# Altium project Lucas Emanuel - PCEIoT.PrjPcb (part 1 of 2)
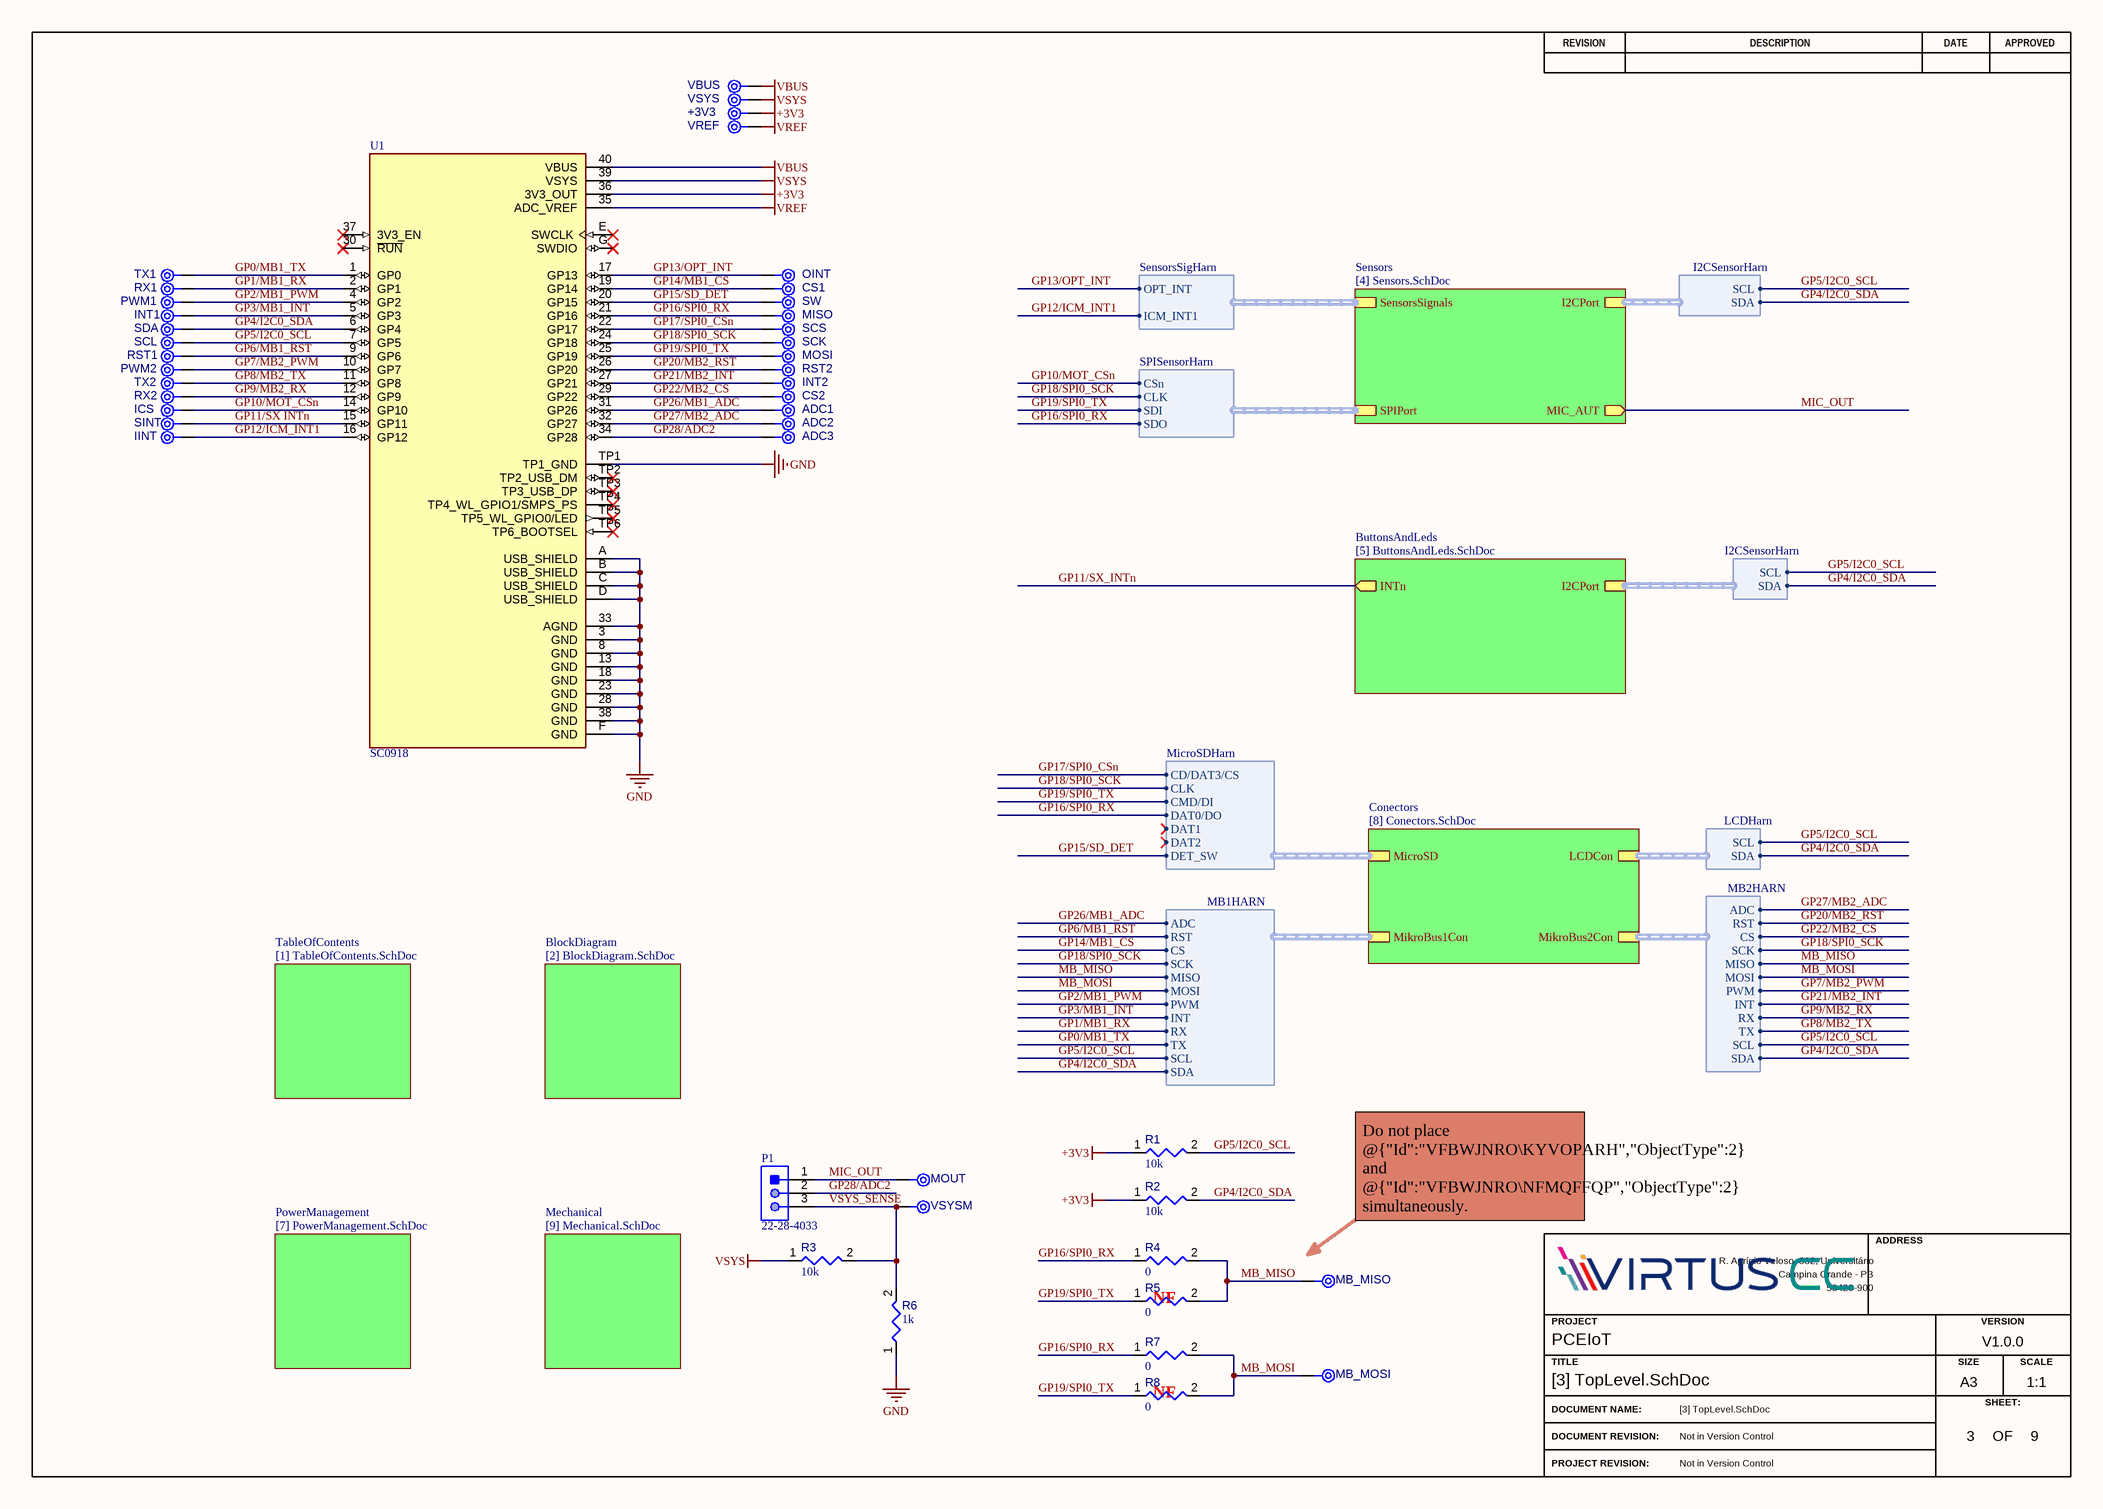
[diagram p0: [3] TopLevel.SchDoc]
Address1: R. Aprígio Veloso, 882, Universitário; Address2: Campina Grande - PB; Address3: 58429-900; DocumentRev: Not in Version Control; Project: PCEIoT; ProjectRev: Not in Version Control; SCH_SCALE: 1:1; Version: V1.0.0
9 sheets, 171 parts. Net scope: hierarchical (ports join the sheet entries above them; power ports are global).
Board file: PCB1.PcbDoc
Sheets:
  [3] TopLevel.SchDoc
    PowerManagement = [7] PowerManagement.SchDoc
    TableOfContents = [1] TableOfContents.SchDoc
    BlockDiagram = [2] BlockDiagram.SchDoc
    Mechanical = [9] Mechanical.SchDoc
    Sensors = [4] Sensors.SchDoc
    ButtonsAndLeds = [5] ButtonsAndLeds.SchDoc
      "RGB LEDs"1 = [6] RgbLed.SchDoc
      "RGB LEDs"2 = [6] RgbLed.SchDoc
      "RGB LEDs"3 = [6] RgbLed.SchDoc
    Conectors = [8] Conectors.SchDoc

## Sheet [3] TopLevel.SchDoc
size A3; DocumentNumber: 3; SheetNumber: 3; SheetTotal: 9

### Parts
+3V3  TPAD6R  [TP06R]  (value not drawn)  (no BOM)
ADC1  TPAD6R  [TP06R]  (value not drawn)  (no BOM)
ADC2  TPAD6R  [TP06R]  (value not drawn)  (no BOM)
ADC3  TPAD6R  [TP06R]  (value not drawn)  (no BOM)
CS1  TPAD6R  [TP06R]  (value not drawn)  (no BOM)
CS2  TPAD6R  [TP06R]  (value not drawn)  (no BOM)
ICS  TPAD6R  [TP06R]  (value not drawn)  (no BOM)
IINT  TPAD6R  [TP06R]  (value not drawn)  (no BOM)
INT1  TPAD6R  [TP06R]  (value not drawn)  (no BOM)
INT2  TPAD6R  [TP06R]  (value not drawn)  (no BOM)
MB_MISO  TPAD6R  [TP06R]  (value not drawn)  (no BOM)
MB_MOSI  TPAD6R  [TP06R]  (value not drawn)  (no BOM)
MISO  TPAD6R  [TP06R]  (value not drawn)  (no BOM)
MOSI  TPAD6R  [TP06R]  (value not drawn)  (no BOM)
MOUT  TPAD6R  [TP06R]  (value not drawn)  (no BOM)
OINT  TPAD6R  [TP06R]  (value not drawn)  (no BOM)
P1  22-28-4033  [MOLX-22-28-4033_V]
PWM1  TPAD6R  [TP06R]  (value not drawn)  (no BOM)
PWM2  TPAD6R  [TP06R]  (value not drawn)  (no BOM)
R1  value 10k  [RESC0603(1608)_L]  (hidden comment: Resistor 10k +/-1% 0603 100 mW)
R2  value 10k  [RESC0603(1608)_L]  (hidden comment: Resistor 10k +/-1% 0603 100 mW)
R3  value 10k  [RESC0603(1608)_L]  (hidden comment: Resistor 10k +/-1% 0603 100 mW)
R4  value 0  [RESC0603(1608)_L]  (hidden comment: Resistor 0R +/- 5% 0603 100 mW)
R5  value 0  [RESC0603(1608)_L]  (hidden comment: Resistor 0R +/- 5% 0603 100 mW)
R6  value 1k  [RESC0603(1608)_L]  (hidden comment: Resistor 1k +/-1% 0603 100 mW)
R7  value 0  [RESC0603(1608)_L]  (hidden comment: Resistor 0R +/- 5% 0603 100 mW)
R8  value 0  [RESC0603(1608)_L]  (hidden comment: Resistor 0R +/- 5% 0603 100 mW)
RST1  TPAD6R  [TP06R]  (value not drawn)  (no BOM)
RST2  TPAD6R  [TP06R]  (value not drawn)  (no BOM)
RX1  TPAD6R  [TP06R]  (value not drawn)  (no BOM)
RX2  TPAD6R  [TP06R]  (value not drawn)  (no BOM)
SCK  TPAD6R  [TP06R]  (value not drawn)  (no BOM)
SCL  TPAD6R  [TP06R]  (value not drawn)  (no BOM)
SCS  TPAD6R  [TP06R]  (value not drawn)  (no BOM)
SDA  TPAD6R  [TP06R]  (value not drawn)  (no BOM)
SINT  TPAD6R  [TP06R]  (value not drawn)  (no BOM)
SW  TPAD6R  [TP06R]  (value not drawn)  (no BOM)
TX1  TPAD6R  [TP06R]  (value not drawn)  (no BOM)
TX2  TPAD6R  [TP06R]  (value not drawn)  (no BOM)
U1  SC0918  [MODULE_SC0918]
VBUS  TPAD6R  [TP06R]  (value not drawn)  (no BOM)
VREF  TPAD6R  [TP06R]  (value not drawn)  (no BOM)
VSYS  TPAD6R  [TP06R]  (value not drawn)  (no BOM)
VSYSM  TPAD6R  [TP06R]  (value not drawn)  (no BOM)

### Sub-sheets
BlockDiagram = [2] BlockDiagram.SchDoc: no entries
ButtonsAndLeds = [5] ButtonsAndLeds.SchDoc: INTn (out), I2CPort (harness I2CSensorHarn)
Conectors = [8] Conectors.SchDoc: MikroBus2Con (harness MB2HARN), MikroBus1Con (harness MB1HARN), MicroSD (harness MicroSDHarn), LCDCon (harness LCDHarn)
Mechanical = [9] Mechanical.SchDoc: no entries
PowerManagement = [7] PowerManagement.SchDoc: no entries
Sensors = [4] Sensors.SchDoc: SPIPort (harness SPISensorHarn), SensorsSignals (harness SensorsSigHarn), I2CPort (harness I2CSensorHarn), MIC_AUT (out)
TableOfContents = [1] TableOfContents.SchDoc: no entries

### Harnesses
I2CSensorHarn: SCL, SDA
SensorsSigHarn: OPT_INT, ICM_INT1
SPISensorHarn: CSn, CLK, SDI, SDO
LCDHarn: SCL, SDA
MB2HARN: ADC, RST, CS, SCK, MISO, MOSI, PWM, INT, RX, TX, SCL, SDA
MB1HARN: ADC, RST, CS, SCK, MISO, MOSI, PWM, INT, RX, TX, SCL, SDA
MicroSDHarn: CLK, CMD/DI, DAT0/DO, DAT1, DAT2, CD/DAT3/CS, DET_SW

### Nets
+3V3: +3V3.1(TP) R1.1 R2.1 U1.36(3V3_OUT)
GND: R6.1 U1.3(GND) U1.8(GND) U1.13(GND) U1.18(GND) U1.23(GND) U1.28(GND) U1.33(AGND) U1.38(GND) U1.A(USB_SHIELD) U1.B(USB_SHIELD) U1.C(USB_SHIELD) U1.D(USB_SHIELD) U1.F(GND) U1.TP1(TP1_GND)
VBUS: U1.40(VBUS) VBUS.1(TP)
VREF: U1.35(ADC_VREF) VREF.1(TP)
VSYS: R3.1 U1.39(VSYS) VSYS.1(TP)
GP0/MB1_TX: TX1.1(TP) U1.1(GP0) ; sheet Conectors/MikroBus1Con.TX
GP1/MB1_RX: RX1.1(TP) U1.2(GP1) ; sheet Conectors/MikroBus1Con.RX
GP2/MB1_PWM: PWM1.1(TP) U1.4(GP2) ; sheet Conectors/MikroBus1Con.PWM
GP3/MB1_INT: INT1.1(TP) U1.5(GP3) ; sheet Conectors/MikroBus1Con.INT
GP4/I2C0_SDA: R2.2 SDA.1(TP) U1.6(GP4) ; sheet Sensors/I2CPort.SDA, sheet Conectors/LCDCon.SDA, sheet Conectors/MikroBus2Con.SDA, sheet Conectors/MikroBus1Con.SDA, sheet ButtonsAndLeds/I2CPort.SDA
GP5/I2C0_SCL: R1.2 SCL.1(TP) U1.7(GP5) ; sheet Sensors/I2CPort.SCL, sheet Conectors/LCDCon.SCL, sheet Conectors/MikroBus2Con.SCL, sheet Conectors/MikroBus1Con.SCL, sheet ButtonsAndLeds/I2CPort.SCL
GP6/MB1_RST: RST1.1(TP) U1.9(GP6) ; sheet Conectors/MikroBus1Con.RST
GP7/MB2_PWM: PWM2.1(TP) U1.10(GP7) ; sheet Conectors/MikroBus2Con.PWM
GP8/MB2_TX: TX2.1(TP) U1.11(GP8) ; sheet Conectors/MikroBus2Con.TX
GP9/MB2_RX: RX2.1(TP) U1.12(GP9) ; sheet Conectors/MikroBus2Con.RX
GP10/MOT_CSn: ICS.1(TP) U1.14(GP10) ; sheet Sensors/SPIPort.CSn
GP11/SX INTn: SINT.1(TP) U1.15(GP11)
GP12/ICM_INT1: IINT.1(TP) U1.16(GP12) ; sheet Sensors/SensorsSignals.ICM_INT1
GP13/OPT_INT: OINT.1(TP) U1.17(GP13) ; sheet Sensors/SensorsSignals.OPT_INT
GP14/MB1_CS: CS1.1(TP) U1.19(GP14) ; sheet Conectors/MikroBus1Con.CS
GP15/SD_DET: SW.1(TP) U1.20(GP15) ; sheet Conectors/MicroSD.DET_SW  [project net DET_SW]
GP16/SPI0_RX: MISO.1(TP) R4.1 R7.1 U1.21(GP16) ; sheet Sensors/SPIPort.SDO, sheet Conectors/MicroSD.DAT0/DO  [project net DO]
GP17/SPI0_CSn: SCS.1(TP) U1.22(GP17) ; sheet Conectors/MicroSD.CD/DAT3/CS  [project net CS]
GP18/SPI0_SCK: SCK.1(TP) U1.24(GP18) ; sheet Sensors/SPIPort.CLK, sheet Conectors/MikroBus2Con.SCK, sheet Conectors/MikroBus1Con.SCK, sheet Conectors/MicroSD.CLK  [project net CLK]
GP19/SPI0_TX: MOSI.1(TP) R5.1 R8.1 U1.25(GP19) ; sheet Sensors/SPIPort.SDI, sheet Conectors/MicroSD.CMD/DI  [project net DI]
GP20/MB2_RST: RST2.1(TP) U1.26(GP20) ; sheet Conectors/MikroBus2Con.RST
GP21/MB2_INT: INT2.1(TP) U1.27(GP21) ; sheet Conectors/MikroBus2Con.INT
GP22/MB2_CS: CS2.1(TP) U1.29(GP22) ; sheet Conectors/MikroBus2Con.CS
GP26/MB1_ADC: ADC1.1(TP) U1.31(GP26) ; sheet Conectors/MikroBus1Con.ADC
GP27/MB2_ADC: ADC2.1(TP) U1.32(GP27) ; sheet Conectors/MikroBus2Con.ADC
GP28/ADC2: ADC3.1(TP) P1.2 U1.34(GP28)
MB_MISO: MB_MISO.1(TP) R4.2 R5.2 ; sheet Conectors/MikroBus2Con.MISO, sheet Conectors/MikroBus1Con.MISO  [project net MB1_MISO]
MB_MOSI: MB_MOSI.1(TP) R7.2 R8.2 ; sheet Conectors/MikroBus2Con.MOSI, sheet Conectors/MikroBus1Con.MOSI  [project net MB1_MOSI]
MIC_OUT: MOUT.1(TP) P1.1 ; sheet Sensors/MIC_AUT
VSYS_SENSE: P1.3 R3.2 R6.2 VSYSM.1(TP)

Not connected (* = marked no-connect by the designer): U1 30(~{RUN})* 37(3V3_EN)* E(SWCLK)* G(SWDIO)* TP2(TP2_USB_DM)* TP3(TP3_USB_DP)* TP4(TP4_WL_GPIO1/SMPS_PS)* TP5(TP5_WL_GPIO0/LED)* TP6(TP6_BOOTSEL)*

### Notes on the sheet
- Do not place @{"Id":"VFBWJNRO\KYVOPARH","ObjectType":2} and @{"Id":"VFBWJNRO\NFMQFFQP","ObjectType":2} simultaneously.
  Do not place @{"Id":"VFBWJNRO\IKILTTYE","ObjectType":2} and @{"Id":"VFBWJNRO\AIELESCA","ObjectType":2} simultaneously
- (near R5) NF
- (near R8) NF
- REVISION
- DESCRIPTION
- DATE
- APPROVED
- ADDRESS
- PROJECT
- VERSION
- TITLE
- A3
- SIZE
- SCALE
- DOCUMENT NAME:
- DOCUMENT REVISION:
- OF
- SHEET:
- PROJECT REVISION:

### Library data of the parts
+3V3 ADC1-ADC3 CS1 CS2 ICS IINT INT1 INT2 MB_MISO MB_MOSI MISO MOSI MOUT OINT PWM1 PWM2 RST1 RST2 RX1 RX2 SCK SCL SCS SDA SINT SW TX1 TX2 VBUS VREF VSYS VSYSM = CMP-00028-00002-2: 0.6mm round; Pins: 1; Component Type: Mechanical
P1 = CMP-002-00076-1: KK 254 Breakaway Header Vertical 3 Circuits 0.38um Gold Selective Plating Mating Pin 6.09mm; Pitch: 2.54mm; Number of Positions: 3; Contact Resistance: 20mR; Max Voltage Rating (AC): 250V; Current Rating: 4A; Gender: Male; Glow Wire Compliant: Non-compliant; RoHS Compliant: Yes; Contact Plating: Gold; Housing Color: Black; Housing Material: Nylon; Contact Mating Length: 0.24inch; Depth: 2.49mm; Number of Circuits: 3; Reach SVHC Compliant: Unknown; Packaging: Bulk; Max Voltage Rating (DC): 250V; Number of Rows: 1; Color: Black; Package Quantity: 1; Orientation: Straight; Number of Contacts: 3; Max Operating Temperature: 75°C; Mounting Technology: Through Hole; Min Operating Temperature: 0°C; Termination: Solder; Radiation Hardening: No; Series: KK® 42375; Contact Material: Brass,Bronze; Flammability Rating: UL94 V-0; Lead Free: Lead Free; Contact Type: Male Pin; Voltage Rating: 250V; Voltage Rating (DC): 250V
R1-R3 = CMP-009-00017-7: Chip Resistor, 10 KOhm, +/- 1%, 01 W, -55 to 155 degC, 0603 (1608 Metric); Power: 100mW; Voltage Rating: 50V; Mounting Technology: SM; Max Operating Temperature: 155°C; Case/Package: 0603; Tolerance: 1%; RoHS Compliant: True; Pins: 2; Min Operating Temperature: -55°C
R4 R5 R7 R8 = CMP-009-00006-6: Chip Resistor, 0 Ohm, 0.1 W, -55 to 155 degC, 0603 (1608 Metric); Power: 100mW; Voltage Rating: 50V; Tolerance: 5%; Mounting Technology: SM; RoHS Compliant: True; Max Operating Temperature: 155°C; Min Operating Temperature: -55°C; Case/Package: 0603; Pins: 2
R6 = CMP-009-00014-6: Chip Resistor, 1 KOhm, +/-1%, 0.1 W, -55 to 155 degC, 0603 (1608 Metric); Power: 100mW; Tolerance: 1%; Voltage Rating: 50V; Mounting Technology: SM; Case/Package: 0603; Min Operating Temperature: -55°C; RoHS Compliant: True; Max Operating Temperature: 155°C; Pins: 2
U1 = CMP-006-000001-6: Raspberry Pi Pico W RP2040; Check_prices: https://www.snapeda.com/parts/SC0918/Raspberry+Pi/view-part/?ref=eda; MF: Raspberry Pi; Design Item ID: SC0918; SnapEDA_Link: https://www.snapeda.com/parts/SC0918/Raspberry+Pi/view-part/?ref=snap; Pin Count: 53; Value: *; Purchase-URL: https://pricing.snapeda.com/search/part/SC0918/?ref=eda; MP: SC0918; Source: SC0918.SchLib; Package: None; Availability: In Stock; Price: None; Component Type: Standard

## Sheet [7] PowerManagement.SchDoc
size A3; DocumentNumber: 7; SheetNumber: 7; SheetTotal: 9
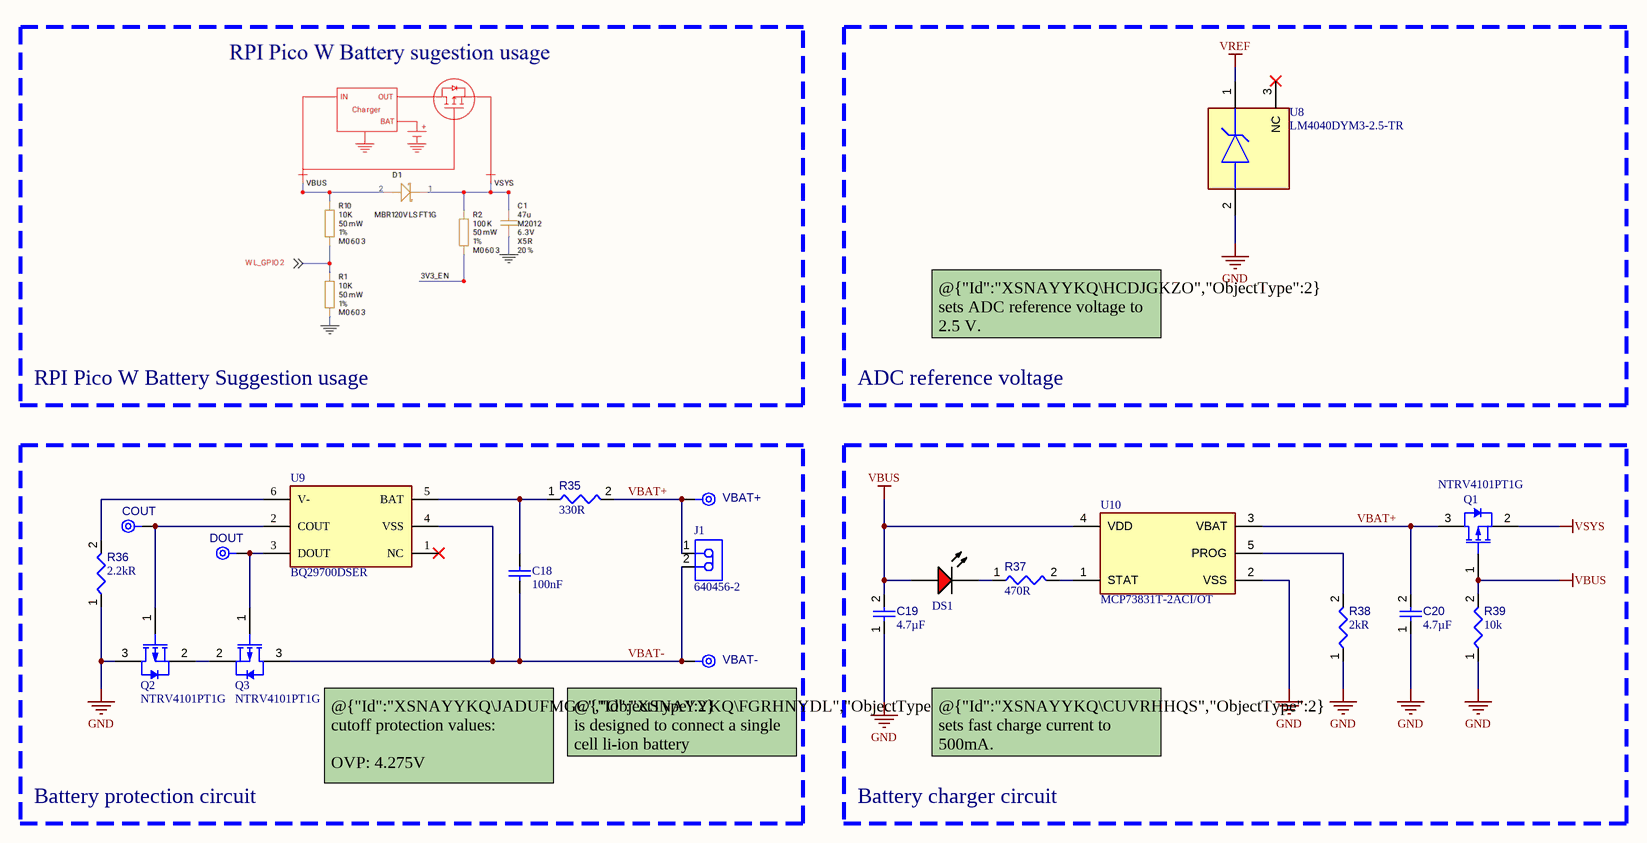
[diagram p1: [7] PowerManagement.SchDoc]

### Parts
C18  value 100nF  [CAPC0603(1608)100_L]  (hidden comment: VJ0603Y104MXJCW1BC)
C19  value 4.7µF  [CAPC0603(1608)100_L]  (hidden comment: Capacitor 4.7µF +/-20% 10V 0603)
C20  value 4.7µF  [CAPC0603(1608)100_L]  (hidden comment: Capacitor 4.7µF +/-20% 10V 0603)
COUT  TPAD6R  [TP06R]  (value not drawn)  (no BOM)
DOUT  TPAD6R  [TP06R]  (value not drawn)  (no BOM)
DS1  19-217/R6C-AL1M2VY/3T  [EVRL-0603-2_V]  (value not drawn)
J1  640456-2  [TECO-640456-2_V]
Q1  NTRV4101PT1G  [ONSC-SOT-23-3-318-08_V]
Q2  NTRV4101PT1G  [ONSC-SOT-23-3-318-08_V]
Q3  NTRV4101PT1G  [ONSC-SOT-23-3-318-08_V]
R35  value 330R  [RESC0603(1608)_L]  (hidden comment: ERJ-3EKF3300V)
R36  value 2.2kR  [RESC0603(1608)_L]  (hidden comment: CRCW06032K20FKEA)
R37  value 470R  [RESC0603(1608)_L]  (hidden comment: CRCW0603470RJNEA)
R38  value 2kR  [RESC0603(1608)_L]  (hidden comment: ERJ-3EKF2001V)
R39  value 10k  [RESC0603(1608)_L]  (hidden comment: Resistor 10k +/-1% 0603 100 mW)
U8  LM4040DYM3-2.5-TR  [FP-SOT23-3LD-PL-1-IPC_A]
U9  BQ29700DSER  [FP-DSE0006A-MFG]
U10  MCP73831T-2ACI/OT  [FP-C04-091-OT-MFG]
VBAT+  TPAD6R  [TP06R]  (value not drawn)  (no BOM)
VBAT-  TPAD6R  [TP06R]  (value not drawn)  (no BOM)

### Blocks framed on the sheet
ADC reference voltage: U8
Battery protection circuit: C18 COUT DOUT J1 Q2 Q3 R35 R36 U9 VBAT+ VBAT-
Battery charger circuit: C19 C20 DS1 Q1 R37-R39 U10

### Nets
GND: C19.1 C20.1 Q2.3(D) R36.1 R38.1 R39.1 U8.2(-) U10.2(VSS)
VBUS: C19.2 DS1.1(A) Q1.1(G) R39.2 U10.4(VDD)
VREF: U8.1(+)
VSYS: Q1.2(S)
VBAT+: C20.2 J1.1 Q1.3(D) R35.2 U10.3(VBAT) VBAT+.1(TP)
VBAT-: C18.1 J1.2 Q3.3(D) U9.4(VSS) VBAT-.1(TP)
NetC18_2: C18.2 R35.1 U9.5(BAT)
NetCOUT_1: COUT.1(TP) Q2.1(G) U9.2(COUT)
NetDOUT_1: DOUT.1(TP) Q3.1(G) U9.3(DOUT)
NetDS1_2: DS1.2(K) R37.1
NetQ2_2: Q2.2(S) Q3.2(S)
NetR36_2: R36.2 U9.6(V-)
NetR37_2: R37.2 U10.1(STAT)
NetR38_2: R38.2 U10.5(PROG)

Not connected (* = marked no-connect by the designer): U8 3(NC)*; U9 1(NC)*

### Notes on the sheet
- @{"Id":"XSNAYYKQ\HCDJGKZO","ObjectType":2} sets ADC reference voltage to 2.5 V.
- RPI Pico W Battery Suggestion usage
- (near VBAT-) @{"Id":"XSNAYYKQ\FGRHNYDL","ObjectType":2} is designed to connect a single cell li-ion battery
- @{"Id":"XSNAYYKQ\CUVRHHQS","ObjectType":2} sets fast charge current to 500mA.
- @{"Id":"XSNAYYKQ\JADUFMGC","ObjectType":2} cutoff protection values:
  OVP: 4.275V
  UVP: 2.8V
- REVISION
- DESCRIPTION
- DATE
- APPROVED
- ADDRESS
- PROJECT
- VERSION
- TITLE
- A3
- SIZE
- SCALE
- DOCUMENT NAME:
- DOCUMENT REVISION:
- OF
- SHEET:
- PROJECT REVISION:

### Library data of the parts
C18 = CMP-001-00085-1: Multilayer Ceramic Capacitor, 0.1 uF, 16 V, ± 20%, X7R, 0603 [1608 Metric]; Dielectric Material: Tantalum; Voltage Rating: 16V; Packaging: Tape and Reel; Min Operating Temperature: -55°C; Case/Package: 0603; Length: 1.6mm; Termination: SMD/SMT; Height: 0.95mm; Mounting Technology: Surface Mount; Width: 0.8mm; Case Code (Imperial): 0603; Construction: Flat; Lead Free: Lead Free; Package Quantity: 4000; Max Operating Temperature: 125°C; Dielectric: X7R; RoHS Compliant: Yes; Depth: 0.8mm; Tolerance: 20%; Series: VJ; Case Code (Metric): 1608; Voltage Rating (DC): 16V
C19 C20 = CMP-001-00076-4: Chip Capacitor, 4.7µF +/-20%, 10V, 0603, Thickness 1 mm; Tolerance: 10%; Mounting Technology: SMT; Case/Package: 0603; Pins: 2; Min Operating Temperature: -55°C; Max Operating Temperature: 85°C; Voltage Rating: 10V
COUT DOUT VBAT+ VBAT- = CMP-00028-00002-2: 0.6mm round; Pins: 1; Component Type: Mechanical
DS1 = CMP-007-00004-2: Chip LED, Red, 5 V, 25 mA, -40 to 85 degC, 2-Pin SMD (0603), RoHS, Tape and Reel; Manufacturer: Everlight Electronics; Forward Voltage: 2.2V; Lens Style: Clear; Package Reference: 0603; Datasheet Version: Rev. 1, 01/2005; Mounting Technology: SM; RoHS Compliant: False; Datasheet URL: https://datasheet.ciiva.com/4688/el-19-217-r6c-al1m2vy-3tpdf-187026-4688713.pdf; Case/Package: 0603; Colour: Red; Manufacturer URL: http://www.everlight.com/; Package Description: 2-Pin Surface Mount Device, Body 1.6 x 0.8 mm
J1 = CMP-002-00073-1: Connector 250V AC/DC 5A 2P 1 Row PCB - Vertical Mounting Polyester White; Contact Retention: No (Without); PCB Thickness: 0.063inch; Approvals: CSA; Contact Post Length: 3.56mm; Gender: Male; Circuit Application: Signal; Tail Length: 0.14inch; Plating Thickness: 3.81um; Plating: Tin; Mating Connector Lock: Yes (With); PCB Mount Retention: Without; Contact Style: Straight; Number of Positions: 2; Connector System: Wire-to-Board; Pitch: 2.54mm; Connector Type: Connector,Pin,Plug,Header; Voltage Rating: 250V; Termination: Solder; Contact Current Rating: 5A; PCB Mount Alignment: No (Without); Housing Material: Polyester; Contact Material: Copper Alloy; Current Rating: 5A; Mounting Ears: No (Without); Strain Relief: No (Without); Shrouded: No (Without); Min Operating Temperature: -67°C; Orientation: Straight; Series: MTA-100; Panel Mount Retention: No (Without); Package Quantity: 5000; Height: 7.87mm; Length: 7.62mm; PCB Mounting Orientation: Vertical; Flammability Rating: UL94 V-0; Operating Supply Voltage: 250V; Contact Plating: Tin; Mounting Technology: Through Hole; Voltage Rating (AC): 250V; Backwall/Post Interruptions: No (Without); Contact Mating Length: 7.49mm; Color: Beige; Voltage Rating (DC): 250V; Lead Free: Lead Free; Reach SVHC Compliant: Unknown; Sealable: No (Without); Mating Alignment: No (Without); Mating Retention: No (Without); Number of Contacts: 2; Contact Shape: Square; Max Operating Temperature: 221°C; Number of Rows: 1; RoHS Compliant: Yes; Housing Color: Natural
Q1-Q3 = CMP-013-00034-1: NTRV4101PT1G P-channel MOSFET Transistor; 1.7 A; 20 V; 3-Pin SOT-23; Gate to Source Voltage (Vgs): 8V; Continuous Drain Current (ID): 3.2A; Input Capacitance: 675pF; Turn-On Delay Time: 7.5ns; Rds On Max: 85mR; Power Dissipation: 1.25W; Rise Time: 12.6ns; Max Power Dissipation: 420mW; Drain to Source Resistance: 70mR; Element Configuration: Single; Turn-Off Delay Time: 30.2ns; Fall Time: 21ns; Drain to Source Voltage (Vdss): 20V; Number of Elements: 1; Case/Package: SOT-23-3; RoHS Compliant: Yes; Polarity: P-CHANNEL; Height: 1.01mm; Packaging: Tape and Reel; Series: -; Package Quantity: 3000; Max Operating Temperature: 150°C; Length: 3.04mm; Lead Free: Lead Free; Pins: 3; Radiation Hardening: No; Width: 1.4mm; Min Operating Temperature: -55°C
R35 = CMP-009-00184-1: SMD Chip Resistor, 330 Ohm, ± 1%, 100 mW, 0603 [1608 Metric], Thick Film, Precision; Current Rating: 500mA; Voltage Rating (DC): 75V; Power Rating: 100mW; Gender: Male; Temperature Coefficient: 100ppm/°C; Termination: SMD/SMT; Construction: Rectangular; Contact Plating: Tin; Resistor Type: Thick Film; Features: Automotive AEC-Q200; Max Operating Temperature: 155°C; Weight: 7.1E-05oz; Package Quantity: 5000; Lead Pitch: 1.1mm; Radiation Hardening: No; Lead Free: Lead Free; Min Operating Temperature: -55°C; Reach SVHC Compliant: No; Pins: 2; Number of Terminations: 2; Width: 0.8mm; RoHS Compliant: Yes; Depth: 0.8mm; Packaging: Tape and Reel; Voltage Rating: 75V; Mounting Technology: Surface Mount; Case Code (Metric): 1608; Resistance Tolerance: 1%; Tolerance: 1%; Case Code (Imperial): 0603; Length: 1.6mm; Height: 0.45mm; Military Standard: Not; Series: ERJ; Max Power Dissipation: 100mW; Case/Package: 0603; Contact Material: Copper
R36 = CMP-009-00186-1: SMD Chip Resistor, 2.2 kOhm, ± 1%, 100 mW, 0603 [1608 Metric], Thick Film, General Purpose; Voltage Rating (DC): 75V; Max Power Dissipation: 100mW; Temperature Coefficient: 100ppm/°C; Depth: 0.85mm; Height: 0.45mm; Contact Plating: Tin; Resistance Tolerance: 1%; Ratings: AEC-Q200; Weight: 7.1E-05oz; Series: CRCW; Case Code (Imperial): 0603; Construction: Rectangular; Width: 0.033inch; Reach SVHC Compliant: Unknown; Case Code (Metric): 1608; Resistor Type: Thick Film; Packaging: Tape and Reel; Case/Package: 0603; Package Quantity: 10; RoHS Compliant: Yes; Lead Free: Lead Free; Military Standard: Not; Termination: SMD/SMT; Tolerance: 1%; Technology: THICK FILM; Max Operating Temperature: 155°C; Voltage Rating: 75V; Power Rating: 100mW; Length: 1.55mm; Number of Terminations: 2; Radiation Hardening: No; Min Operating Temperature: -55°C; Features: Automotive AEC-Q200
R37 = CMP-009-00182-1: Res Thick Film 0603 470 Ohm 5% 0.1W(1/10W) ±200ppm/°C Pad SMD Automotive T/R; Max Power Dissipation: 100mW; Working Voltage: 75V; Case Code (Metric): 1608; Case Code (Imperial): 0603; Width: 0.85mm; Series: CRCW; Max Operating Temperature: 155°C; Features: Automotive AEC-Q200; Height: 0.45mm; Technology: THICK FILM; Power Rating: 100mW; Depth: 0.85mm; Min Operating Temperature: -55°C; Weight: 7.1E-05oz; RoHS Compliant: Yes; Number of Terminations: 2; Voltage Rating: 75V; Ratings: AEC-Q200; Case/Package: 0603; Contact Plating: Tin; Radiation Hardening: No; Termination: SMD/SMT; Tolerance: 5%; Construction: Rectangular; Package Quantity: 5000; Reach SVHC Compliant: Unknown; Length: 1.55mm; Resistor Type: Thick Film; Lead Free: Lead Free; Temperature Coefficient: 200ppm/°C; Resistance Tolerance: 5%; Packaging: Tape and Reel; Military Standard: Not
R38 = CMP-009-00181-1: SMD Chip Resistor, 2 kOhm, ï¿½ 1%, 100 mW, 0603 [1608 Metric], Thick Film, Precision; Power Rating: 100mW; Temperature Coefficient: 100ppm/°C; Voltage Rating: 75V; Voltage Rating (DC): 50V; Construction: Rectangular; Tolerance: 1%; Case Code (Imperial): 0603; Contact Plating: Tin; Packaging: Tape and Reel; Width: 0.8mm; Length: 1.6mm; Lead Free: Lead Free; Max Operating Temperature: 155°C; Number of Terminations: 2; Features: Automotive AEC-Q200; Min Operating Temperature: -55°C; Termination: SMD/SMT; Case/Package: 0603; Max Power Dissipation: 100mW; Reach SVHC Compliant: No; Radiation Hardening: No; RoHS Compliant: Yes; Resistance Tolerance: 1%; Pins: 2; Series: ERJ; Case Code (Metric): 1608; Mounting Technology: Surface Mount; Height: 0.022inch; Military Standard: Not; Depth: 0.8mm; Package Quantity: 1; Resistor Type: Thick Film
R39 = CMP-009-00017-7: as R1 on sheet [3] TopLevel; Mounting Technology: SM; Max Operating Temperature: 155°C; Case/Package: 0603; Tolerance: 1%; RoHS Compliant: True; Pins: 2; Min Operating Temperature: -55°C
U8 = CMP-004-00033-1: LM4040 Series 2.5 V ±1 % Precision Micropower Shunt Voltage Reference - SOT-23; Max Output Voltage: 2.5V; Output Type: Fixed; Output Voltage: 10V; Cathode Current: 70uA; Temperature Coefficient: 150ppm/°C; Output Current: 15mA; Tolerance: 1%; Supply Current: 500nA; Max Operating Temperature: 85°C; Series: -; Min Output Voltage: 2.5V; Length: 2.92mm; Current Rating: 15mA; Pins: 3; Height: 1.01mm; Package Quantity: 3000; Max Output current: 15mA; Min Operating Temperature: -40°C; Packaging: Tape and Reel; Width: 1.3mm; Radiation Hardening: No; Case/Package: SOT-23; Reach SVHC Compliant: No; Reference Voltage: 2.5V; Lead Free: Lead Free; RoHS Compliant: Yes; Reference Type: Shunt; Mounting Technology: Surface Mount
U9 = CMP-001-0002-1: Li-Ion/Li Polymer Advanced Single-Cell Battery Protector IC Family 6-WSON -40 to 85; Fault Protection: Over Current,Short Circuit,Over/Under Voltage; Operating Supply Voltage: 8V; Number of Cells: 1; Case/Package: WFDFN; Lead Free: Lead Free; Pins: 6; Height: 800um; Packaging: Tape and Reel; Max Operating Temperature: 85°C; Weight: 0.000342oz; Mounting Technology: Surface Mount; Series: -; Contact Plating: Gold; Thickness: 750um; RoHS Compliant: Yes; Package Quantity: 3000; Width: 1.5mm; Length: 1.5mm; Min Operating Temperature: -40°C
U10 = CMP-001-0001-1: MCP73831 Series Single-Cell Li-Ion/Li-Polymer Battery Charge Controller SOT-23-5; Output Voltage: 4.2V; Number of Channels: 1; Fault Protection: Over Voltage; Min Supply Voltage: 3.75V; Max Supply Voltage: 6V; Max Power Dissipation: 1.54W; Output Current: 500mA; Voltage Rating: 4.534V; Drain to Source Resistance: 350mR; Min Output Voltage: 4.168V; Max Output Voltage: 4.5V; Mounting Technology: Surface Mount; Number of Outputs: 1; RoHS Compliant: Yes; Weight: 0.00709oz; Length: 3.1mm; Max Operating Temperature: 85°C; Series: -; Case/Package: SOT-23; Radiation Hardening: No; Pins: 5; Packaging: Tape and Reel; Lead Free: Lead Free; Number of Cells: 1; Width: 1.8mm; Height: 1.3mm; Max Charge Current: 500mA; Battery Pack Voltage: 4.2V; Reach SVHC Compliant: No; Termination: SMD/SMT; Min Operating Temperature: -40°C

## Sheet [1] TableOfContents.SchDoc
size A3; DocumentNumber: 1; SheetNumber: 1; SheetTotal: 9
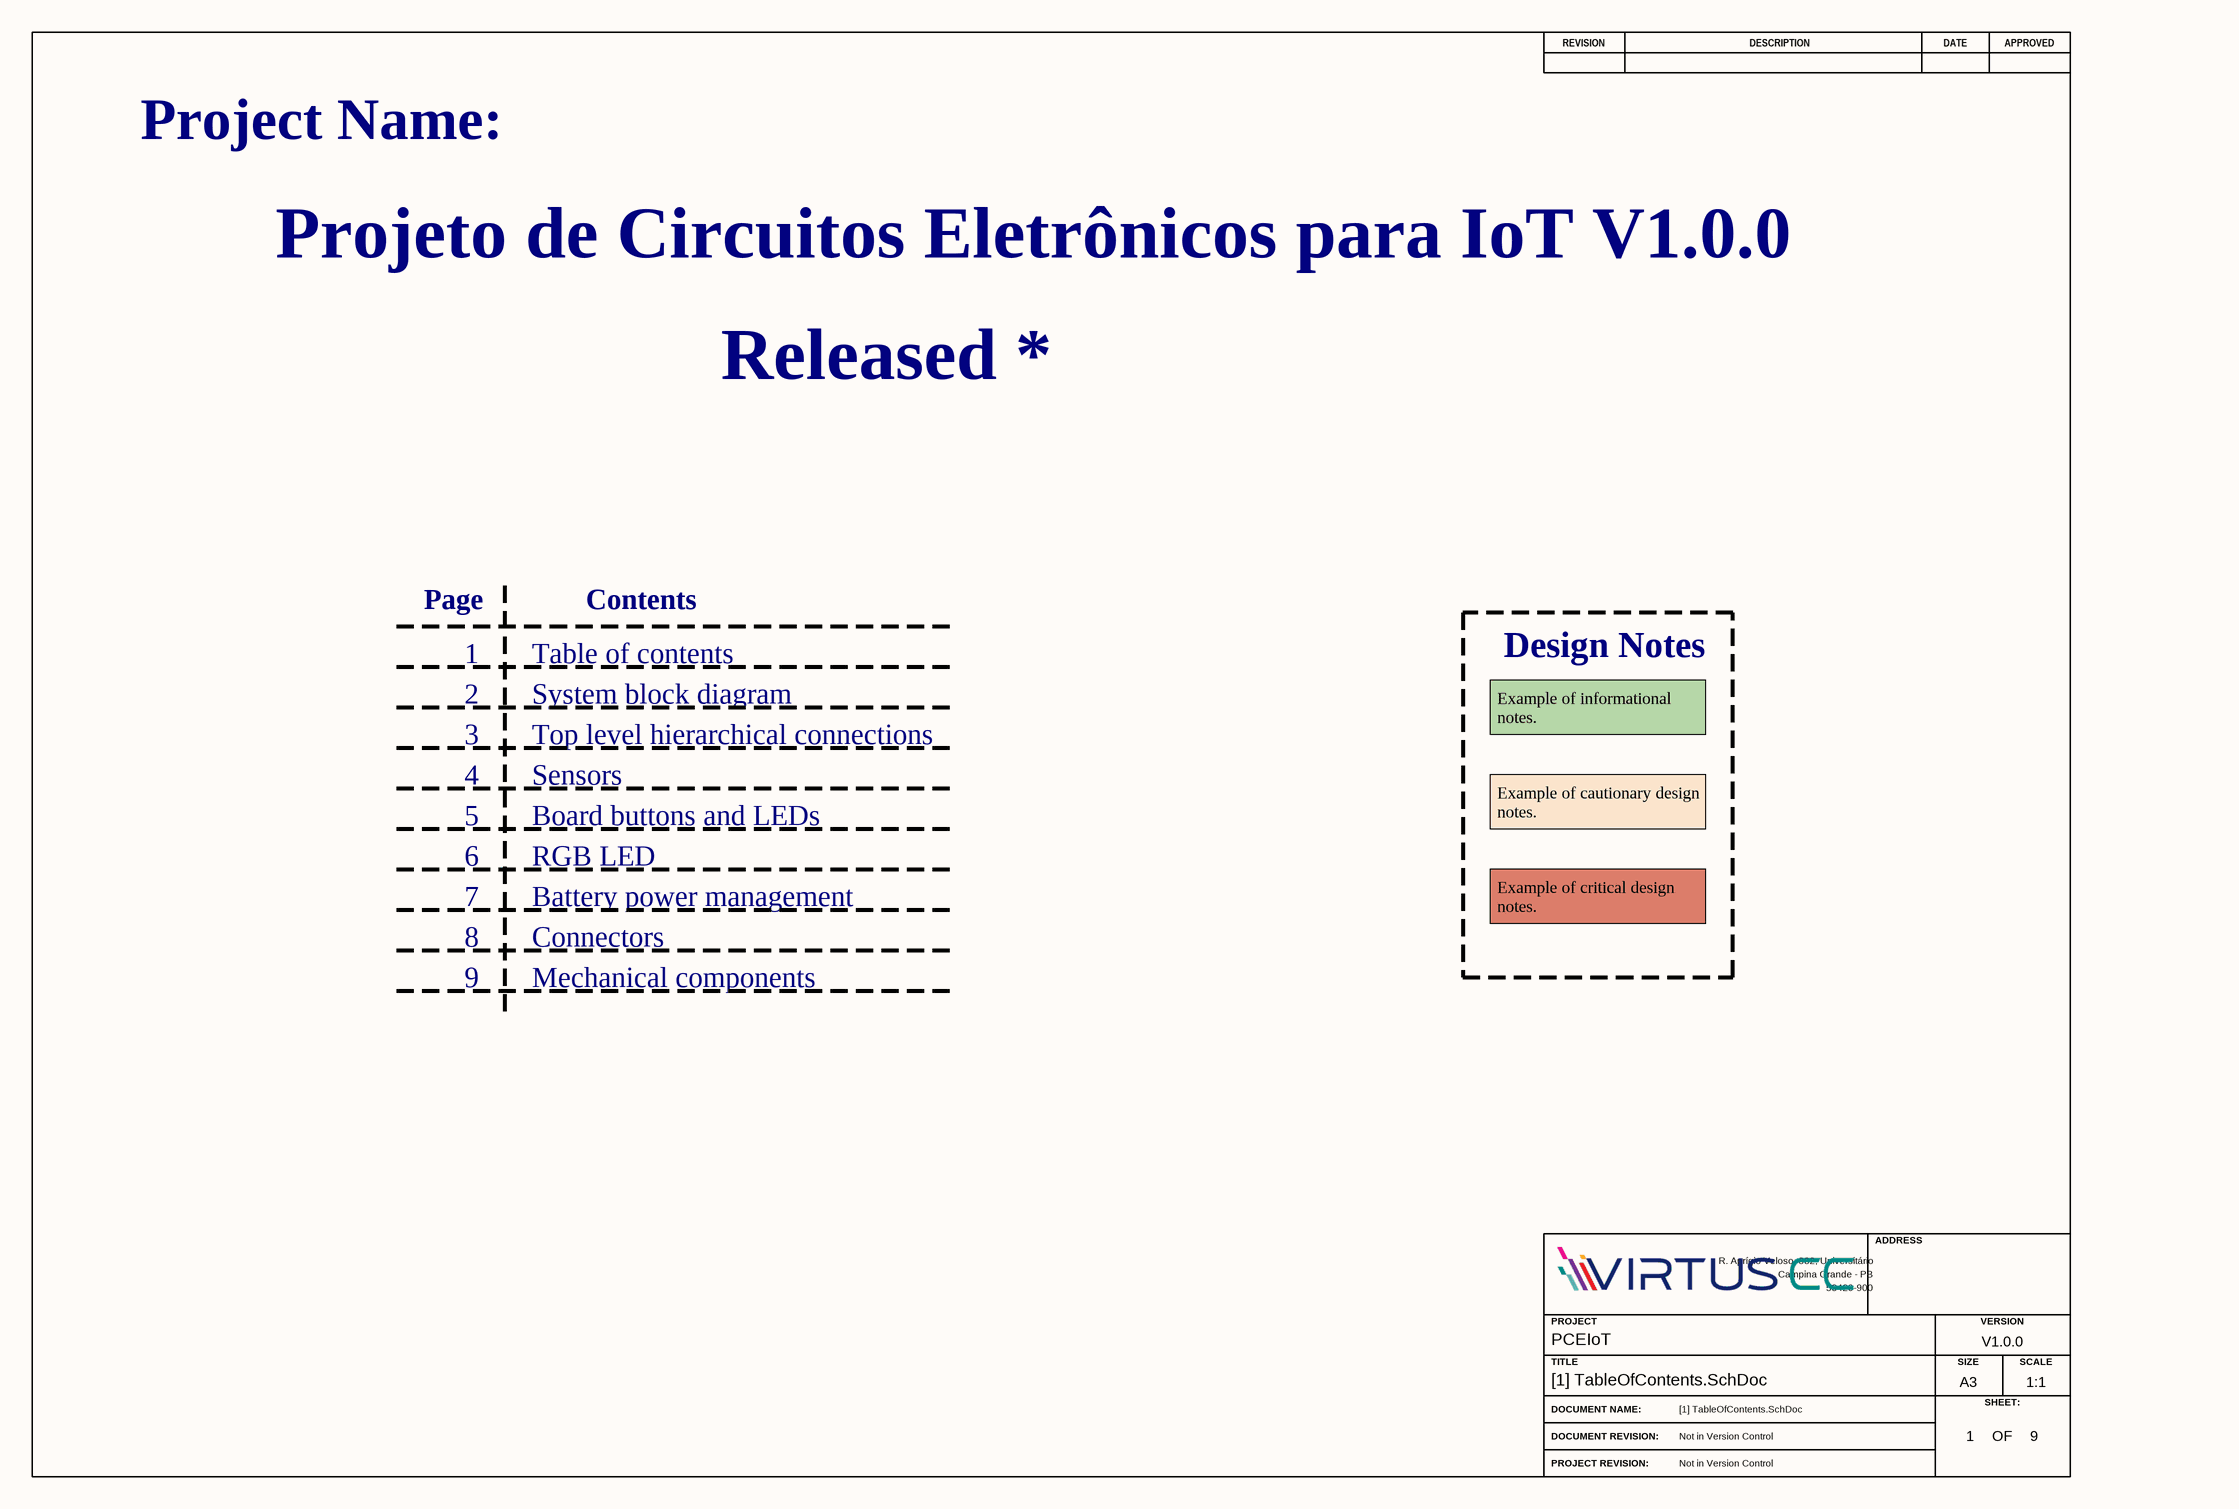
[diagram p2: [1] TableOfContents.SchDoc]

### Notes on the sheet
- Project Name:
- Projeto de Circuitos Eletrônicos para IoT V1.0.0
- Page
- 1
- Table of contents
- Contents
- 2
- System block diagram
- Design Notes
- 3
- 4
- Top level hierarchical connections
- Sensors
- Example of informational notes.
- 5
- 6
- Board buttons and LEDs
- RGB LED
- Example of cautionary design notes.
- 7
- Battery power management
- Example of critical design notes.
- 8
- 9
- Connectors
- Mechanical components
- REVISION
- DESCRIPTION
- DATE
- APPROVED
- ADDRESS
- PROJECT
- VERSION
- TITLE
- A3
- SIZE
- SCALE
- DOCUMENT NAME:
- DOCUMENT REVISION:
- OF
- SHEET:
- PROJECT REVISION:

## Sheet [2] BlockDiagram.SchDoc
size A3; DocumentNumber: 2; SheetNumber: 2; SheetTotal: 9
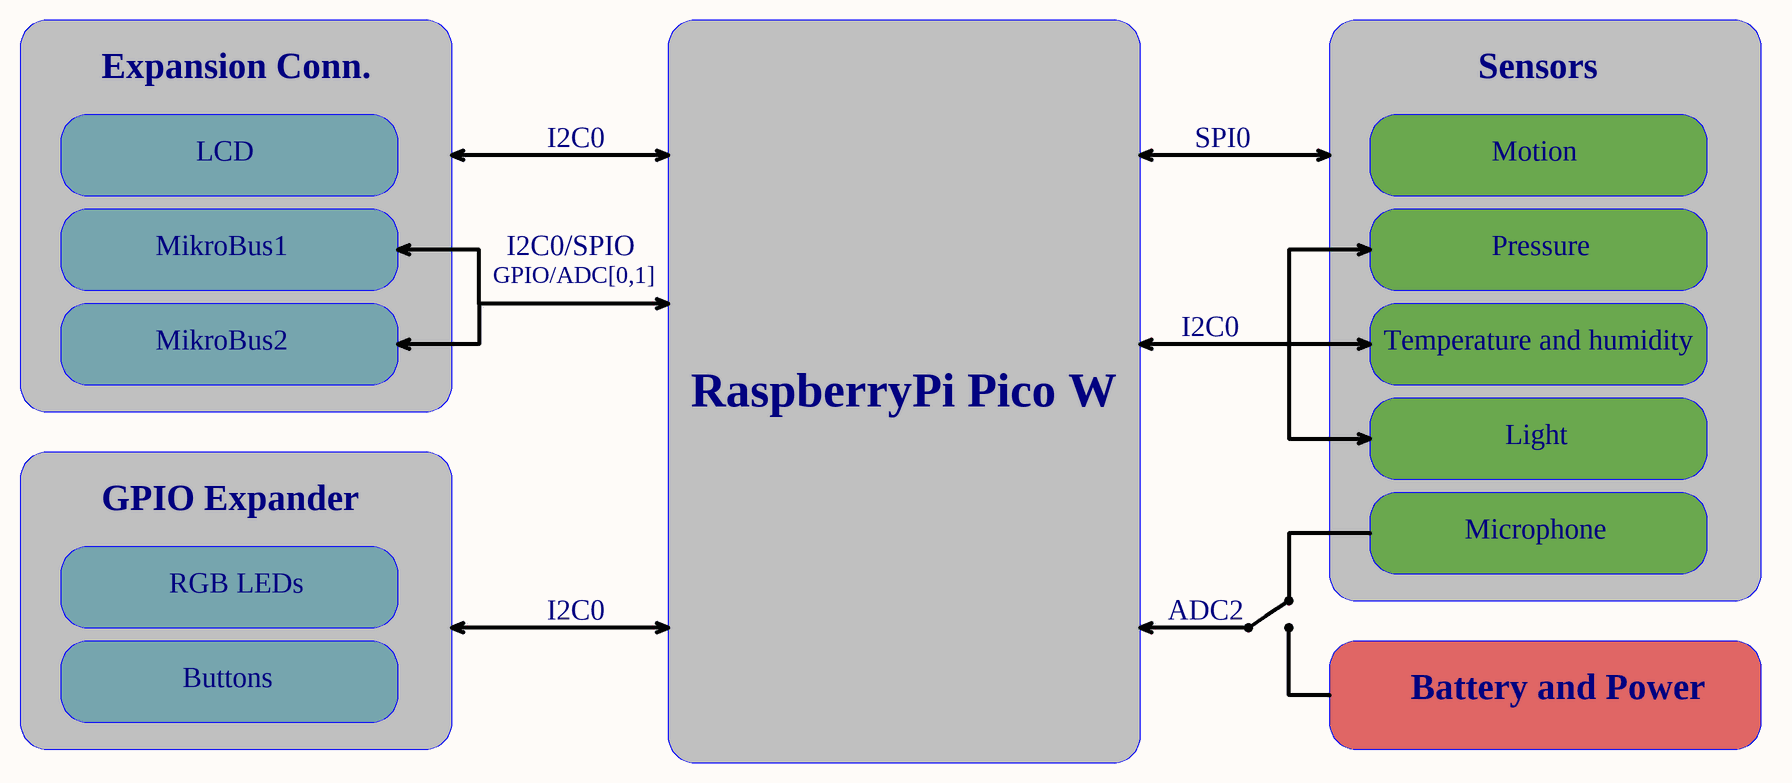
[diagram p3: [2] BlockDiagram.SchDoc]

### Notes on the sheet
- Expansion Conn.
- Sensors
- I2C0
- SPI0
- LCD
- Motion
- MikroBus1
- GPIO/ADC[0,1]
- I2C0/SPIO
- Pressure
- MikroBus2
- Temperature and humidity
- RaspberryPi Pico W
- Light
- GPIO Expander
- Microphone
- RGB LEDs
- ADC2
- Buttons
- Battery and Power
- REVISION
- DESCRIPTION
- DATE
- APPROVED
- ADDRESS
- PROJECT
- VERSION
- TITLE
- A3
- SIZE
- SCALE
- DOCUMENT NAME:
- DOCUMENT REVISION:
- OF
- SHEET:
- PROJECT REVISION:

## Sheet [9] Mechanical.SchDoc
size A3; DocumentNumber: 9; SheetNumber: 9; SheetTotal: 9
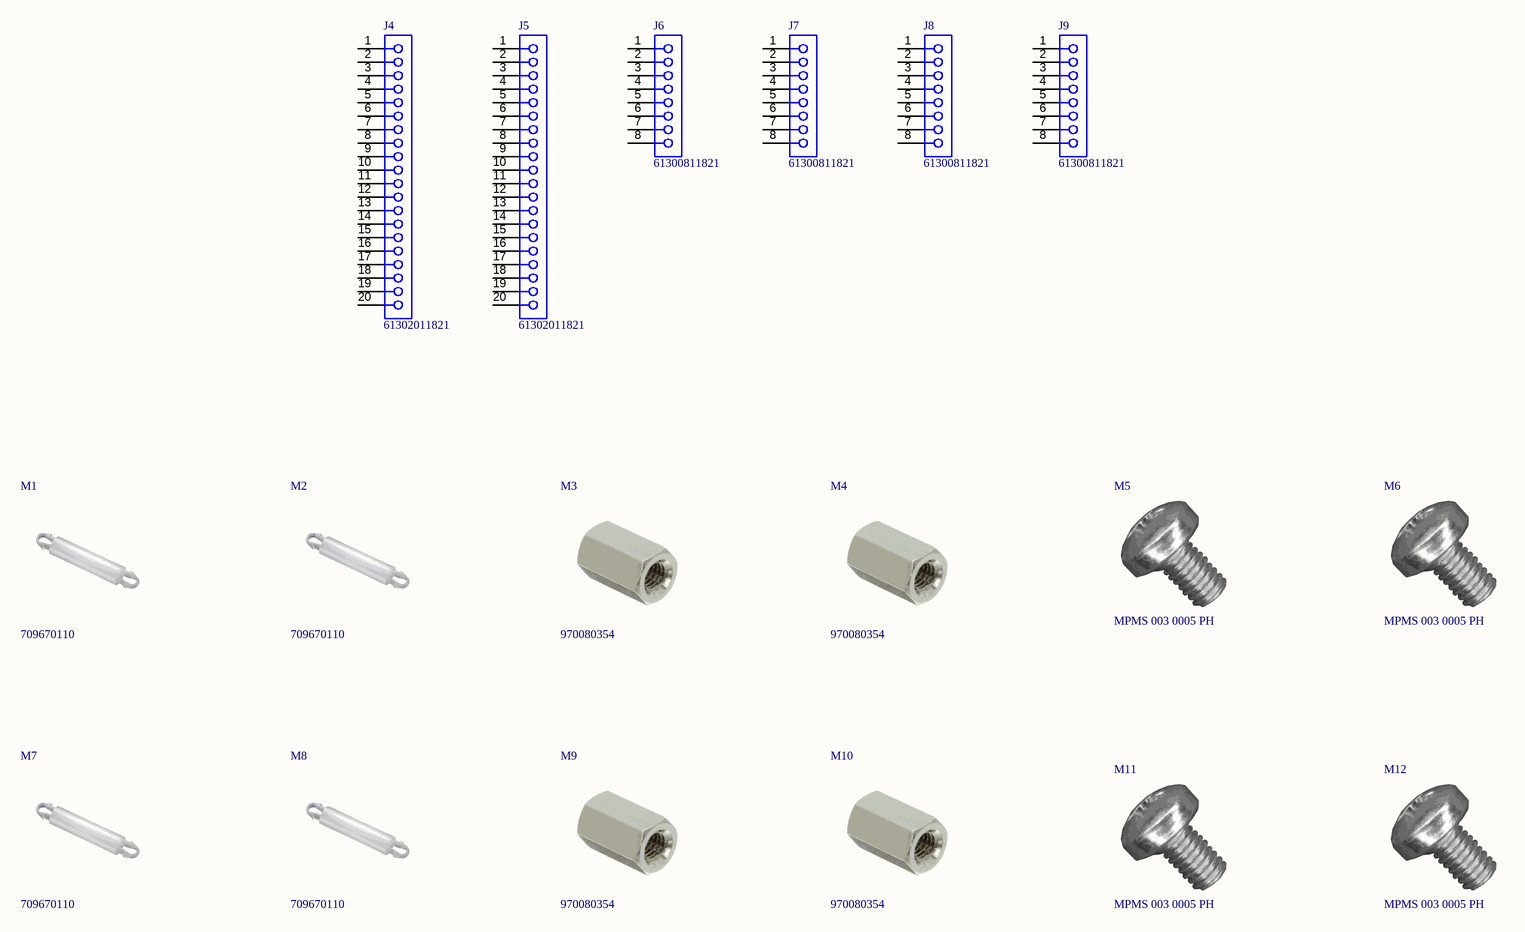
[diagram p4: [9] Mechanical.SchDoc]

### Parts
J4  61302011821  [61302011821]
J5  61302011821  [61302011821]
J6  61300811821  [61300811821]
J7  61300811821  [61300811821]
J8  61300811821  [61300811821]
J9  61300811821  [61300811821]
M1  709670110  (mechanical)
M2  709670110  (mechanical)
M3  970080354  (mechanical)
M4  970080354  (mechanical)
M5  MPMS 003 0005 PH  (mechanical)
M6  MPMS 003 0005 PH  (mechanical)
M7  709670110  (mechanical)
M8  709670110  (mechanical)
M9  970080354  (mechanical)
M10  970080354  (mechanical)
M11  MPMS 003 0005 PH  (mechanical)
M12  MPMS 003 0005 PH  (mechanical)

### Nets

Not connected (* = marked no-connect by the designer): J4 1 2 3 4 5 6 7 8 9 10 11 12 13 14 15 16 17 18 19 20; J5 1 2 3 4 5 6 7 8 9 10 11 12 13 14 15 16 17 18 19 20; J6 1 2 3 4 5 6 7 8; J7 1 2 3 4 5 6 7 8; J8 1 2 3 4 5 6 7 8; J9 1 2 3 4 5 6 7 8

### Notes on the sheet
- REVISION
- DESCRIPTION
- DATE
- APPROVED
- ADDRESS
- PROJECT
- VERSION
- TITLE
- A3
- SIZE
- SCALE
- DOCUMENT NAME:
- DOCUMENT REVISION:
- OF
- SHEET:
- PROJECT REVISION:

### Library data of the parts
J4 J5 = CMP-002-00074-1: THT Vertical Socket Header WR-PHD, Pitch 2.54 mm, Single Row, 20 pins; Contact Resistance: 20mR; Operating Supply Voltage: 250V; Current Rating: 3A; Gender: Female; Orientation: Vertical; Pins: 20; Lead Pitch: 2.54mm; RoHS Compliant: Yes
J6-J9 = CMP-002-00075-1: Btb Conn, Rcpt, 8Pos, 1Row, 2.54Mm Rohs Compliant: Yes; Operating Supply Voltage: 250V; Gender: Female; Contact Resistance: 20mR; Current Rating: 3A; Pins: 8; Lead Pitch: 2.54mm; Orientation: Vertical; RoHS Compliant: Yes
M1 M2 M7 M8 = CMP-00028-00009-2: Pcb Mounting, Nylon 6.6, 11Mm Rohs Compliant: Yes; Material: Nylon; Series: WA-SNSN
M3 M4 M9 M10 = CMP-00028-00008-4: WA-SBRII Brass Spacer Stud Metric Thread int./int.; Gender: Female, Female; Threaded/Unthreaded: Threaded; Thread Size: M3; Plating: Nickel; Series: WA-SBRII; Color: Silver; Material: Brass
M5 M6 M11 M12 = CMP-00028-00007-2: Mach Screw Pan Head Phillips M3; Lead Free: Contains Lead

## Sheet [4] Sensors.SchDoc
size A3; DocumentNumber: 4; SheetNumber: 4; SheetTotal: 9
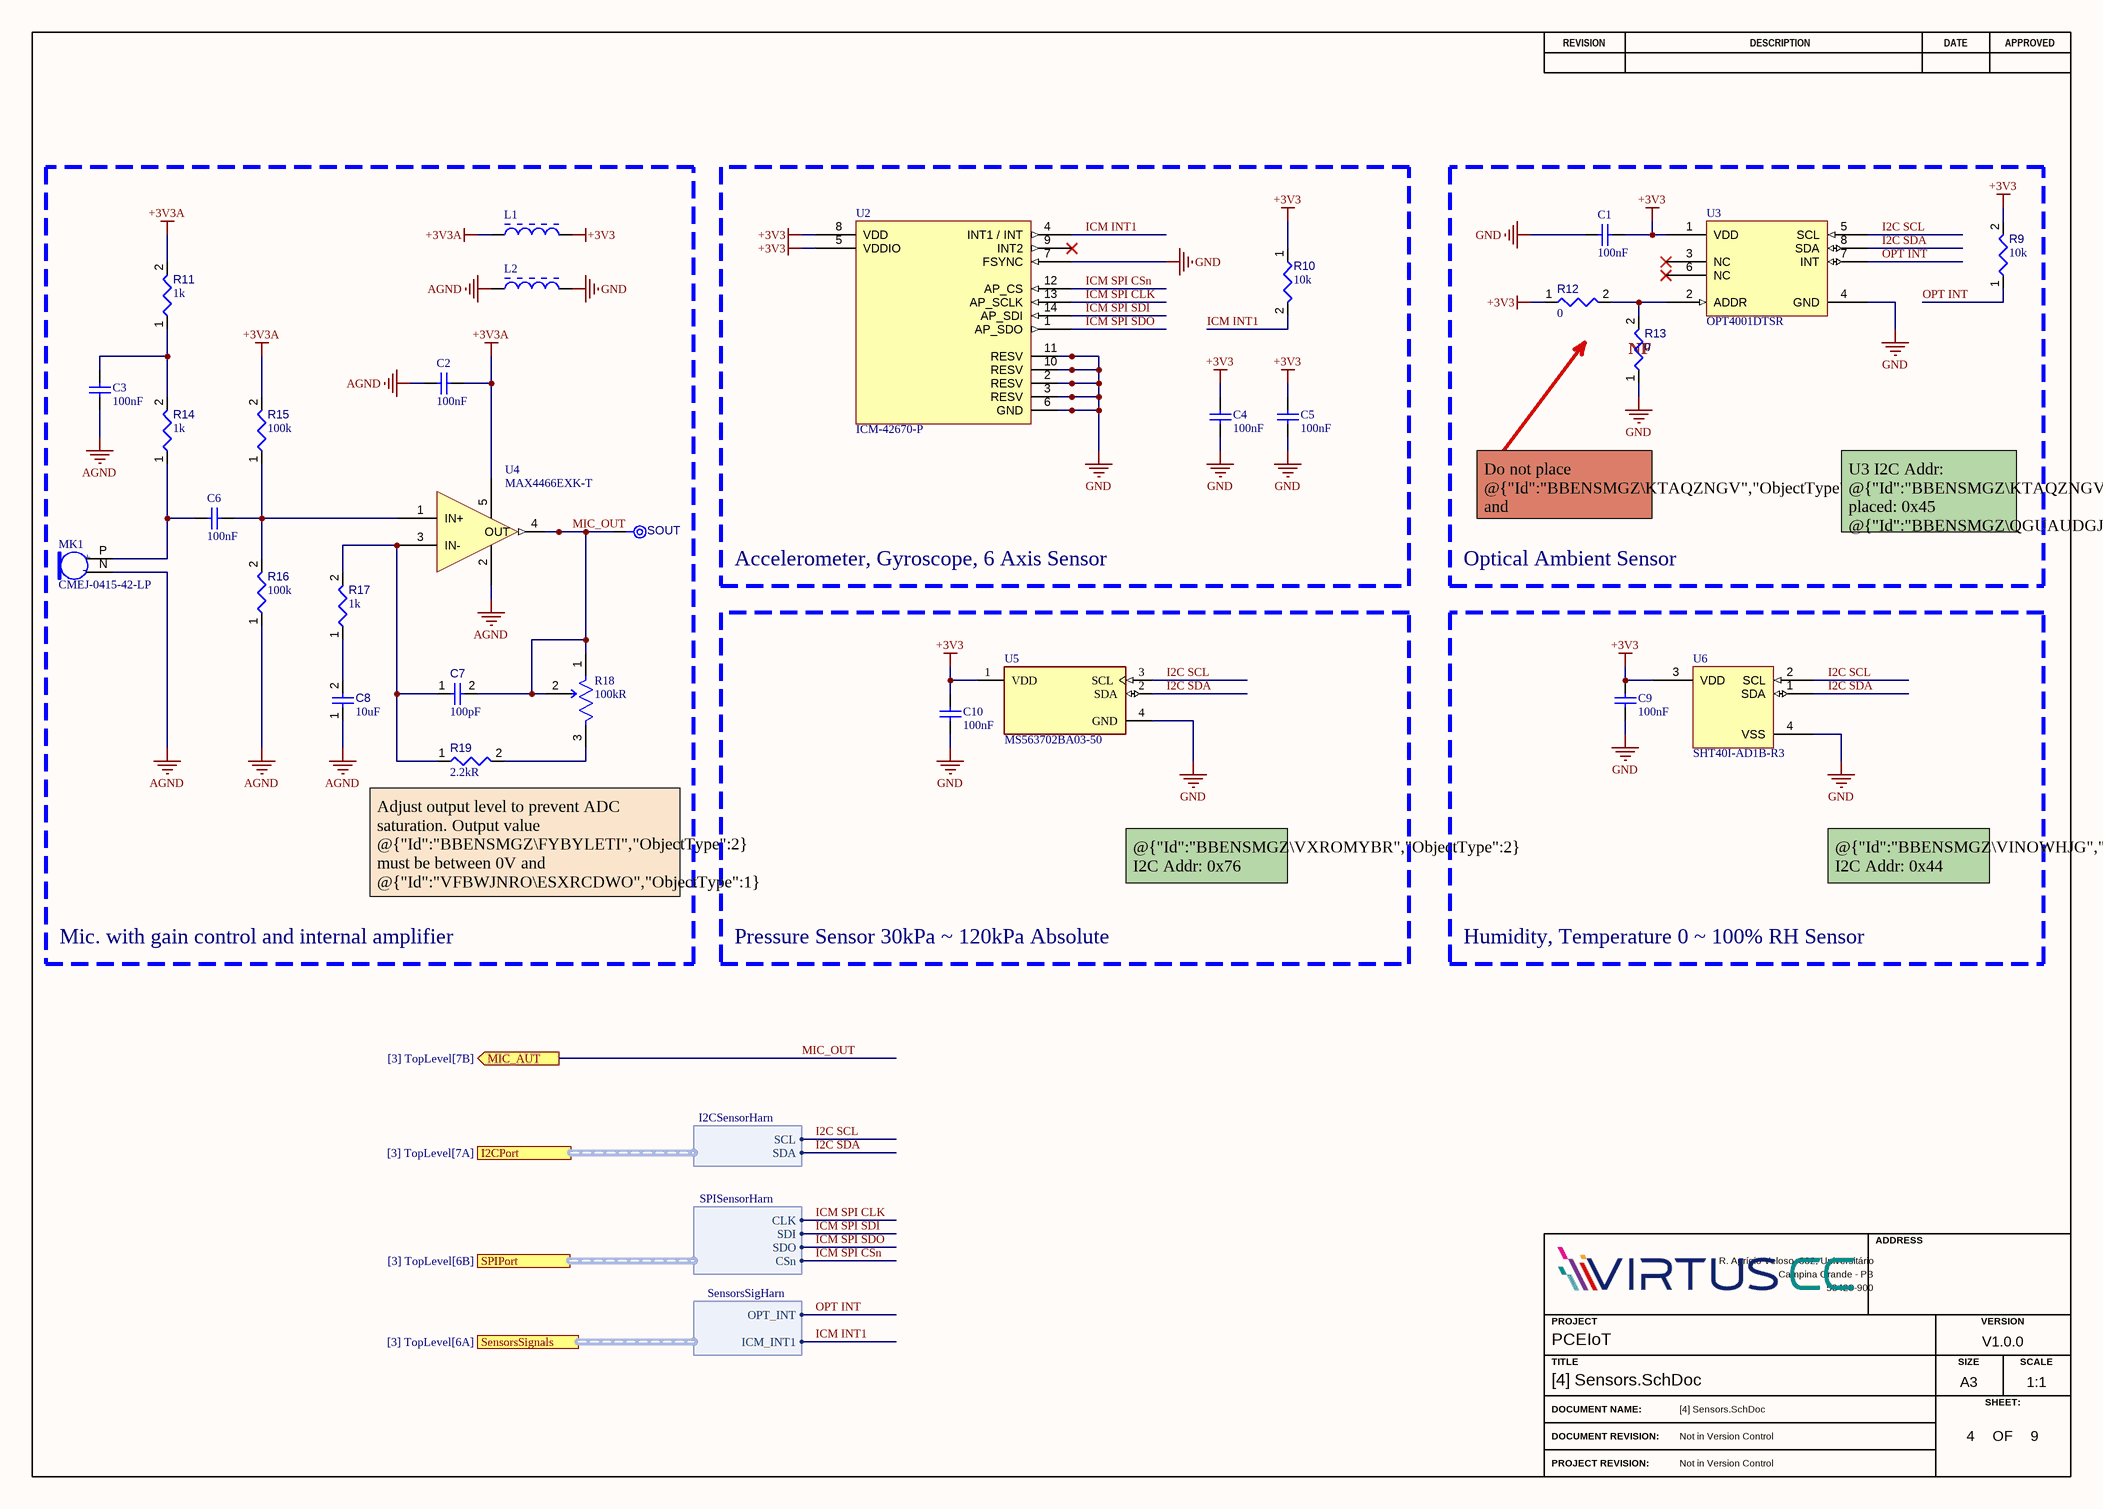
[diagram p5: [4] Sensors.SchDoc]

### Parts
C1  value 100nF  [CAPC0603(1608)100_L]  (hidden comment: VJ0603Y104MXJCW1BC)
C2  value 100nF  [CAPC0603(1608)100_L]  (hidden comment: VJ0603Y104MXJCW1BC)
C3  value 100nF  [CAPC0603(1608)100_L]  (hidden comment: VJ0603Y104MXJCW1BC)
C4  value 100nF  [CAPC0603(1608)100_L]  (hidden comment: VJ0603Y104MXJCW1BC)
C5  value 100nF  [CAPC0603(1608)100_L]  (hidden comment: VJ0603Y104MXJCW1BC)
C6  value 100nF  [CAPC0603(1608)100_L]  (hidden comment: VJ0603Y104MXJCW1BC)
C7  value 100pF  [CAPC0603(1608)100_L]  (hidden comment: C0603C101K5GACTU)
C8  value 10uF  [CAPC0603(1608)100_L]  (hidden comment: GRM188R60J106ME47D)
C9  value 100nF  [CAPC0603(1608)100_L]  (hidden comment: VJ0603Y104MXJCW1BC)
C10  value 100nF  [CAPC0603(1608)100_L]  (hidden comment: VJ0603Y104MXJCW1BC)
L1  BLM21PG331SN1D  [INDC2013X105X50ML20T20]  (value not drawn)
L2  BLM21PG331SN1D  [INDC2013X105X50ML20T20]  (value not drawn)
MK1  CMEJ-0415-42-LP  [MIC_CMEJ-0415-42-LP]
R9  value 10k  [RESC0603(1608)_L]  (hidden comment: Resistor 10k +/-1% 0603 100 mW)
R10  value 10k  [RESC0603(1608)_L]  (hidden comment: Resistor 10k +/-1% 0603 100 mW)
R11  value 1k  [RESC0603(1608)_L]  (hidden comment: Resistor 1k +/-1% 0603 100 mW)
R12  value 0  [RESC0603(1608)_L]  (hidden comment: Resistor 0R +/- 5% 0603 100 mW)
R13  value 0  [RESC0603(1608)_L]  (hidden comment: Resistor 0R +/- 5% 0603 100 mW)
R14  value 1k  [RESC0603(1608)_L]  (hidden comment: Resistor 1k +/-1% 0603 100 mW)
R15  value 100k  [RESC0603(1608)_L]  (hidden comment: Resistor 100k +/-1% 0603 100 mW)
R16  value 100k  [RESC0603(1608)_L]  (hidden comment: Resistor 100k +/-1% 0603 100 mW)
R17  value 1k  [RESC0603(1608)_L]  (hidden comment: Resistor 1k +/-1% 0603 100 mW)
R18  value 100kR  [FP-TC33X-2-MFG]  (hidden comment: TC33X-2-104E)
R19  value 2.2kR  [RESC0603(1608)_L]  (hidden comment: CRCW06032K20FKEA)
SOUT  TPAD6R  [TP06R]  (value not drawn)  (no BOM)
U2  ICM-42670-P  [QFN50P300X250X81-14N]
U3  OPT4001DTSR  [SON50P130X60-8N]
U4  MAX4466EXK-T  [SOT65P200X110-5N]
U5  MS563702BA03-50  [FP-MS563702BA03-50-MFG]
U6  SHT40I-AD1B-R3  [QFN80P150X150X55-4N]

### Blocks framed on the sheet
Mic. with gain control and internal amplifier: C2 C3 C6-C8 L1 L2 MK1 R11 R14-R19 SOUT U4
Accelerometer, Gyroscope, 6 Axis Sensor: C4 C5 R10 U2
Optical Ambient Sensor: C1 R9 R12 R13 U3
Pressure Sensor 30kPa ~ 120kPa Absolute: C10 U5
Humidity, Temperature 0 ~ 100% RH Sensor: C9 U6

### Ports
I2CPort (harness I2CSensorHarn, see [3] TopLevel[7A]), MIC_AUT (out, see [3] TopLevel[7B]), SensorsSignals (harness SensorsSigHarn, see [3] TopLevel[6A]), SPIPort (harness SPISensorHarn, see [3] TopLevel[6B])

### Harnesses
I2CSensorHarn: SCL, SDA
SPISensorHarn: CLK, SDI, SDO, CSn
SensorsSigHarn: OPT_INT, ICM_INT1

### Nets
+3V3: C1.1 C4.2 C5.2 C9.2 C10.2 L1.2 R9.2 R10.1 R12.1 U2.5(VDDIO) U2.8(VDD) U3.1(VDD) U5.1(VDD) U6.3(VDD)
+3V3A: C2.1 L1.1 R11.2 R15.2 U4.5(VCC)
AGND: C2.2 C3.1 C8.1 L2.1 MK1.N(GND) R16.1 U4.2(GND)
GND: C1.2 C4.1 C5.1 C9.1 C10.1 L2.2 R13.1 U2.2(RESV) U2.3(RESV) U2.6(GND) U2.7(FSYNC) U2.10(RESV) U2.11(RESV) U3.4(GND) U5.4(GND) U6.4(VSS)
I2C SCL: U3.5(SCL) U5.3(SCL) U6.2(SCL) ; port I2CPort.SCL  [project net GP5/I2C0_SCL]
I2C SDA: U3.8(SDA) U5.2(SDA) U6.1(SDA) ; port I2CPort.SDA  [project net GP4/I2C0_SDA]
ICM INT1: R10.2 U2.4(INT1_/_INT) ; port SensorsSignals.ICM_INT1  [project net GP12/ICM_INT1]
ICM SPI CLK: U2.13(AP_SCLK) ; port SPIPort.CLK  [project net CLK]
ICM SPI CSn: U2.12(AP_CS) ; port SPIPort.CSn  [project net GP10/MOT_CSn]
ICM SPI SDI: U2.14(AP_SDI) ; port SPIPort.SDI  [project net DI]
ICM SPI SDO: U2.1(AP_SDO) ; port SPIPort.SDO  [project net DO]
MIC_OUT: C7.2 R18.1(CCW) R18.2(WIPER) SOUT.1(TP) U4.4(OUT) ; port MIC_AUT
OPT INT: R9.1 U3.7(INT) ; port SensorsSignals.OPT_INT  [project net GP13/OPT_INT]
NetC3_2: C3.2 R11.1 R14.2
NetC6_1: C6.1 R15.1 R16.2 U4.1(IN+)
NetC6_2: C6.2 MK1.P(OUTPUT) R14.1
NetC7_1: C7.1 R17.2 R19.1 U4.3(IN-)
NetC8_2: C8.2 R17.1
NetR12_2: R12.2 R13.2 U3.2(ADDR)
NetR18_3: R18.3(CW) R19.2

Not connected (* = marked no-connect by the designer): U2 9(INT2)*; U3 3(NC)* 6(NC)*

### Notes on the sheet
- (near R13) NF
- Do not place @{"Id":"BBENSMGZ\KTAQZNGV","ObjectType":2} and @{"Id":"BBENSMGZ\QGUAUDGJ","ObjectType":2} simultaneously
- U3 I2C Addr:
  @{"Id":"BBENSMGZ\KTAQZNGV","ObjectType":2} placed: 0x45
  @{"Id":"BBENSMGZ\QGUAUDGJ","ObjectType":2} placed: 0x44
- (near R19) Adjust output level to prevent ADC saturation. Output value @{"Id":"BBENSMGZ\FYBYLETI","ObjectType":2} must be between 0V and @{"Id":"VFBWJNRO\ESXRCDWO","ObjectType":1} (2.5V according with @{"Id":"XSNAYYKQ\HCDJGKZO","ObjectType":2}
- @{"Id":"BBENSMGZ\VXROMYBR","ObjectType":2} I2C Addr: 0x76
- @{"Id":"BBENSMGZ\VINOWHJG","ObjectType":2} I2C Addr: 0x44
- REVISION
- DESCRIPTION
- DATE
- APPROVED
- ADDRESS
- PROJECT
- VERSION
- TITLE
- A3
- SIZE
- SCALE
- DOCUMENT NAME:
- DOCUMENT REVISION:
- OF
- SHEET:
- PROJECT REVISION:
- (in symbol CMP-010-000001-2) +; -

### Library data of the parts
C1-C6 C9 C10 = CMP-001-00085-1: as C18 on sheet [7] PowerManagement; Packaging: Tape and Reel; Min Operating Temperature: -55°C; Case/Package: 0603; Length: 1.6mm; Termination: SMD/SMT; Height: 0.95mm; Mounting Technology: Surface Mount; Width: 0.8mm; Case Code (Imperial): 0603; Construction: Flat; Lead Free: Lead Free; Package Quantity: 4000; Max Operating Temperature: 125°C; Dielectric: X7R; RoHS Compliant: Yes; Depth: 0.8mm; Tolerance: 20%; Series: VJ; Case Code (Metric): 1608; Voltage Rating (DC): 16V
C7 = CMP-001-00088-1: Multilayer Ceramic Capacitor, 100 pF, 50 V, ï¿½ 10%, C0G (NP0), 0603 [1608 Metric]; Dissipation Factor: 0.1%; Voltage Rating: 50V; Temperature Coefficient: 30ppm/°C; Min Operating Temperature: -55°C; Dielectric Material: Ceramic; Case/Package: 0603; Depth: 0.8mm; Mounting Technology: Surface Mount,PCB; Tolerance: 10%; Dielectric: C0G; Case Code (Metric): 1608; Height: 0.8mm; RoHS Compliant: Yes; Termination: SMD/SMT; Max Operating Temperature: 125°C; Length: 1.6mm; Packaging: Tape and Reel; Radiation Hardening: No; Voltage Rating (DC): 50V; Package Quantity: 1; Lead Free: Lead Free; Construction: Flat; Lead Pitch: 0.7mm; Series: C; Thickness: 0.034inch; Reach SVHC Compliant: No; Width: 0.031inch; Material: Ceramic; Case Code (Imperial): 0603
C8 = CMP-001-00087-1: Multilayer Ceramic Capacitor, 10 uF, 6.3 V, ± 20%, X5R, 0603 [1608 Metric]; Voltage Rating: 6.3V; Case/Package: 0603; Series: GRM; Mounting Technology: Surface Mount; RoHS Compliant: Yes; Package Quantity: 4000; Case Code (Metric): 1608; Dielectric: X5R; Weight: 0.000222oz; Max Operating Temperature: 85°C; Width: 0.8mm; Termination: Standard; Height: 0.8mm; Tolerance: 20%; Voltage Rating (DC): 6.3V; Length: 1.6mm; Min Operating Temperature: -55°C; Packaging: Cut Tape; Lead Free: Lead Free; Case Code (Imperial): 0603
L1 L2 = CMP-006-00000-4: IND, Chip Ferrite Bead, 330 Ohm, +/- 25%, 1.5 A, -55 to 125 degC, 0805 (2012 Metric), Tape and Reel; Manufacturer: Murata; Impedance: 330Ohm; Current Rating: 1.5A; Resistance: 90mohm; Min Operating Temperature: -55°C; Datasheet Version: Nov-11; Package Quantity: 4000; Datasheet URL: http://psearch.en.murata.com/inductor/product/LQG15HS15NJ02_.pdf; Core Material: Ferrite; Mounting Technology: SM; Package Reference: 0805; Max Current Rating: 1.5A; RoHS Compliant: True; Tolerance: 25%; Max Operating Temperature: 125°C; Package Description: 2-Pin Surface Mount Device, Body 2 x1.25 mm; Case/Package: 0805; Packaging: TapeandReel
MK1 = CMP-010-000001-2: 4.0 mm, Omnidirectional, PCB Mount, 2.0 Vdc, Elecret Condenser Microphone; Frequency: 100Hz; Shape: Circular; Operating Supply Current: 500uA; Voltage Rating: 2V; Output Type: Analog; Clock Frequency: 10kHz; MF: {'manufacturer': u'CUI'}; Value: *; Termination: PC Pins; Availability: Unavailable; Width: 4mm; Design Item ID: CMEJ-0415-42-LP; Series: CMEJ; Direction: Omnidirectional; Pin Count: 2; Price: None; Component Type: Standard; Package: None; MP: CMEJ-0415-42-LP; Operating Supply Voltage: 2V; Length: 4mm; Height: 1.5mm; Source: CMEJ-0415-42-LP.SchLib
R9 R10 = CMP-009-00017-7: as R1 on sheet [3] TopLevel; Mounting Technology: SM; Max Operating Temperature: 155°C; Case/Package: 0603; Tolerance: 1%; RoHS Compliant: True; Pins: 2; Min Operating Temperature: -55°C
R11 R14 R17 = CMP-009-00014-6: as R6 on sheet [3] TopLevel; Mounting Technology: SM; Case/Package: 0603; Min Operating Temperature: -55°C; RoHS Compliant: True; Max Operating Temperature: 155°C; Pins: 2
R12 R13 = CMP-009-00006-6: as R4 on sheet [3] TopLevel; Tolerance: 5%; Mounting Technology: SM; RoHS Compliant: True; Max Operating Temperature: 155°C; Min Operating Temperature: -55°C; Case/Package: 0603; Pins: 2
R15 R16 = CMP-009-00023-6: Chip Resistor, 100 KOhm, +/- 1%, 0.1 W, -55 to 155 degC, 0603 (1608 Metric); Power: 100mW; Voltage Rating: 50V; Tolerance: 1%; RoHS Compliant: True; Pins: 2; Min Operating Temperature: -55°C; Case/Package: 0603; Max Operating Temperature: 155°C; Mounting Technology: SM
R18 = CMP-009-00187-1: Cermet trimmer potentiometer, 100 kΩ, 0.1 W, SMD, on top, TC33X-2-104E; Resistance Tolerance: 25%; Voltage Rating (DC): 50V; Power Rating: 100mW; Temperature Coefficient: 250ppm/°C; Number of Turns: 1; Mounting Technology: Surface Mount; Pins: 2; Resistor Type: Carbon,Cermet; Tolerance: 25%; Min Operating Temperature: -40°C; Radiation Hardening: No; Length: 0.15inch; Max Operating Temperature: 100°C; Height: 0.047inch; RoHS Compliant: Yes; Max Power Dissipation: 100mW; Depth: 3.8mm; Reach SVHC Compliant: No; Military Standard: Not; Series: TC33; Width: 0.118inch; Weight: 29.4mg; Termination: Foot Print; Package Quantity: 1; Packaging: Tape and Reel
R19 = CMP-009-00186-1: as R36 on sheet [7] PowerManagement; Depth: 0.85mm; Height: 0.45mm; Contact Plating: Tin; Resistance Tolerance: 1%; Ratings: AEC-Q200; Weight: 7.1E-05oz; Series: CRCW; Case Code (Imperial): 0603; Construction: Rectangular; Width: 0.033inch; Reach SVHC Compliant: Unknown; Case Code (Metric): 1608; Resistor Type: Thick Film; Packaging: Tape and Reel; Case/Package: 0603; Package Quantity: 10; RoHS Compliant: Yes; Lead Free: Lead Free; Military Standard: Not; Termination: SMD/SMT; Tolerance: 1%; Technology: THICK FILM; Max Operating Temperature: 155°C; Voltage Rating: 75V; Power Rating: 100mW; Length: 1.55mm; Number of Terminations: 2; Radiation Hardening: No; Min Operating Temperature: -55°C; Features: Automotive AEC-Q200
SOUT = CMP-00028-00002-2: 0.6mm round; Pins: 1; Component Type: Mechanical
U2 = CMP-010-00032-3: Mems Module, 1.71-3.6 V, Lga-14 Rohs Compliant: Yes; Width: 3mm; Length: 2.5mm; Min Operating Temperature: -40°C
U3 = CMP-010-00031-2: High-speed high-precision digital ambient light sensor (ALS) 8-SOT-5X3 -40 to 85; Length: 2.1mm; Height: 600um; Width: 1.2mm; Thickness: 550um; Pins: 8
U4 = CMP-00027-00002-4: Audio Amp Microphone 1-CH Mono Class-AB 5-Pin SC-70 T/R; Max Supply Voltage: 5.5V; Min Supply Voltage: 2.4V; Gain Bandwidth Product: 600kHz; Power Supply Rejection Ratio (PSRR): 112dB; RoHS Compliant: No; Radiation Hardening: No; Series: -; Packaging: Tape and Reel; Mounting Technology: Surface Mount; Max Operating Temperature: 85°C; Min Operating Temperature: -40°C
U5 = CMP-010-00027-2: Pressure Sensor, Barometric, 300 mbar, 1200 mbar, QFN, 8, -40 C; Min Supply Voltage: 1.8V; Max Supply Voltage: 3.6V; Supply Current: 20.09uA; Pins: 8; Packaging: Cut Tape; Min Operating Temperature: -40°C; Lead Free: Lead Free; RoHS Compliant: Yes; Height: 1mm; Max Operating Temperature: 85°C; Reach SVHC Compliant: No; Pressure Type: Barometric; Case/Package: QFN
U6 = CMP-010-00033-3: Humidity And Temperature Sensor

## Sheet [5] ButtonsAndLeds.SchDoc
size A3; DocumentNumber: 5; SheetNumber: 5; SheetTotal: 9
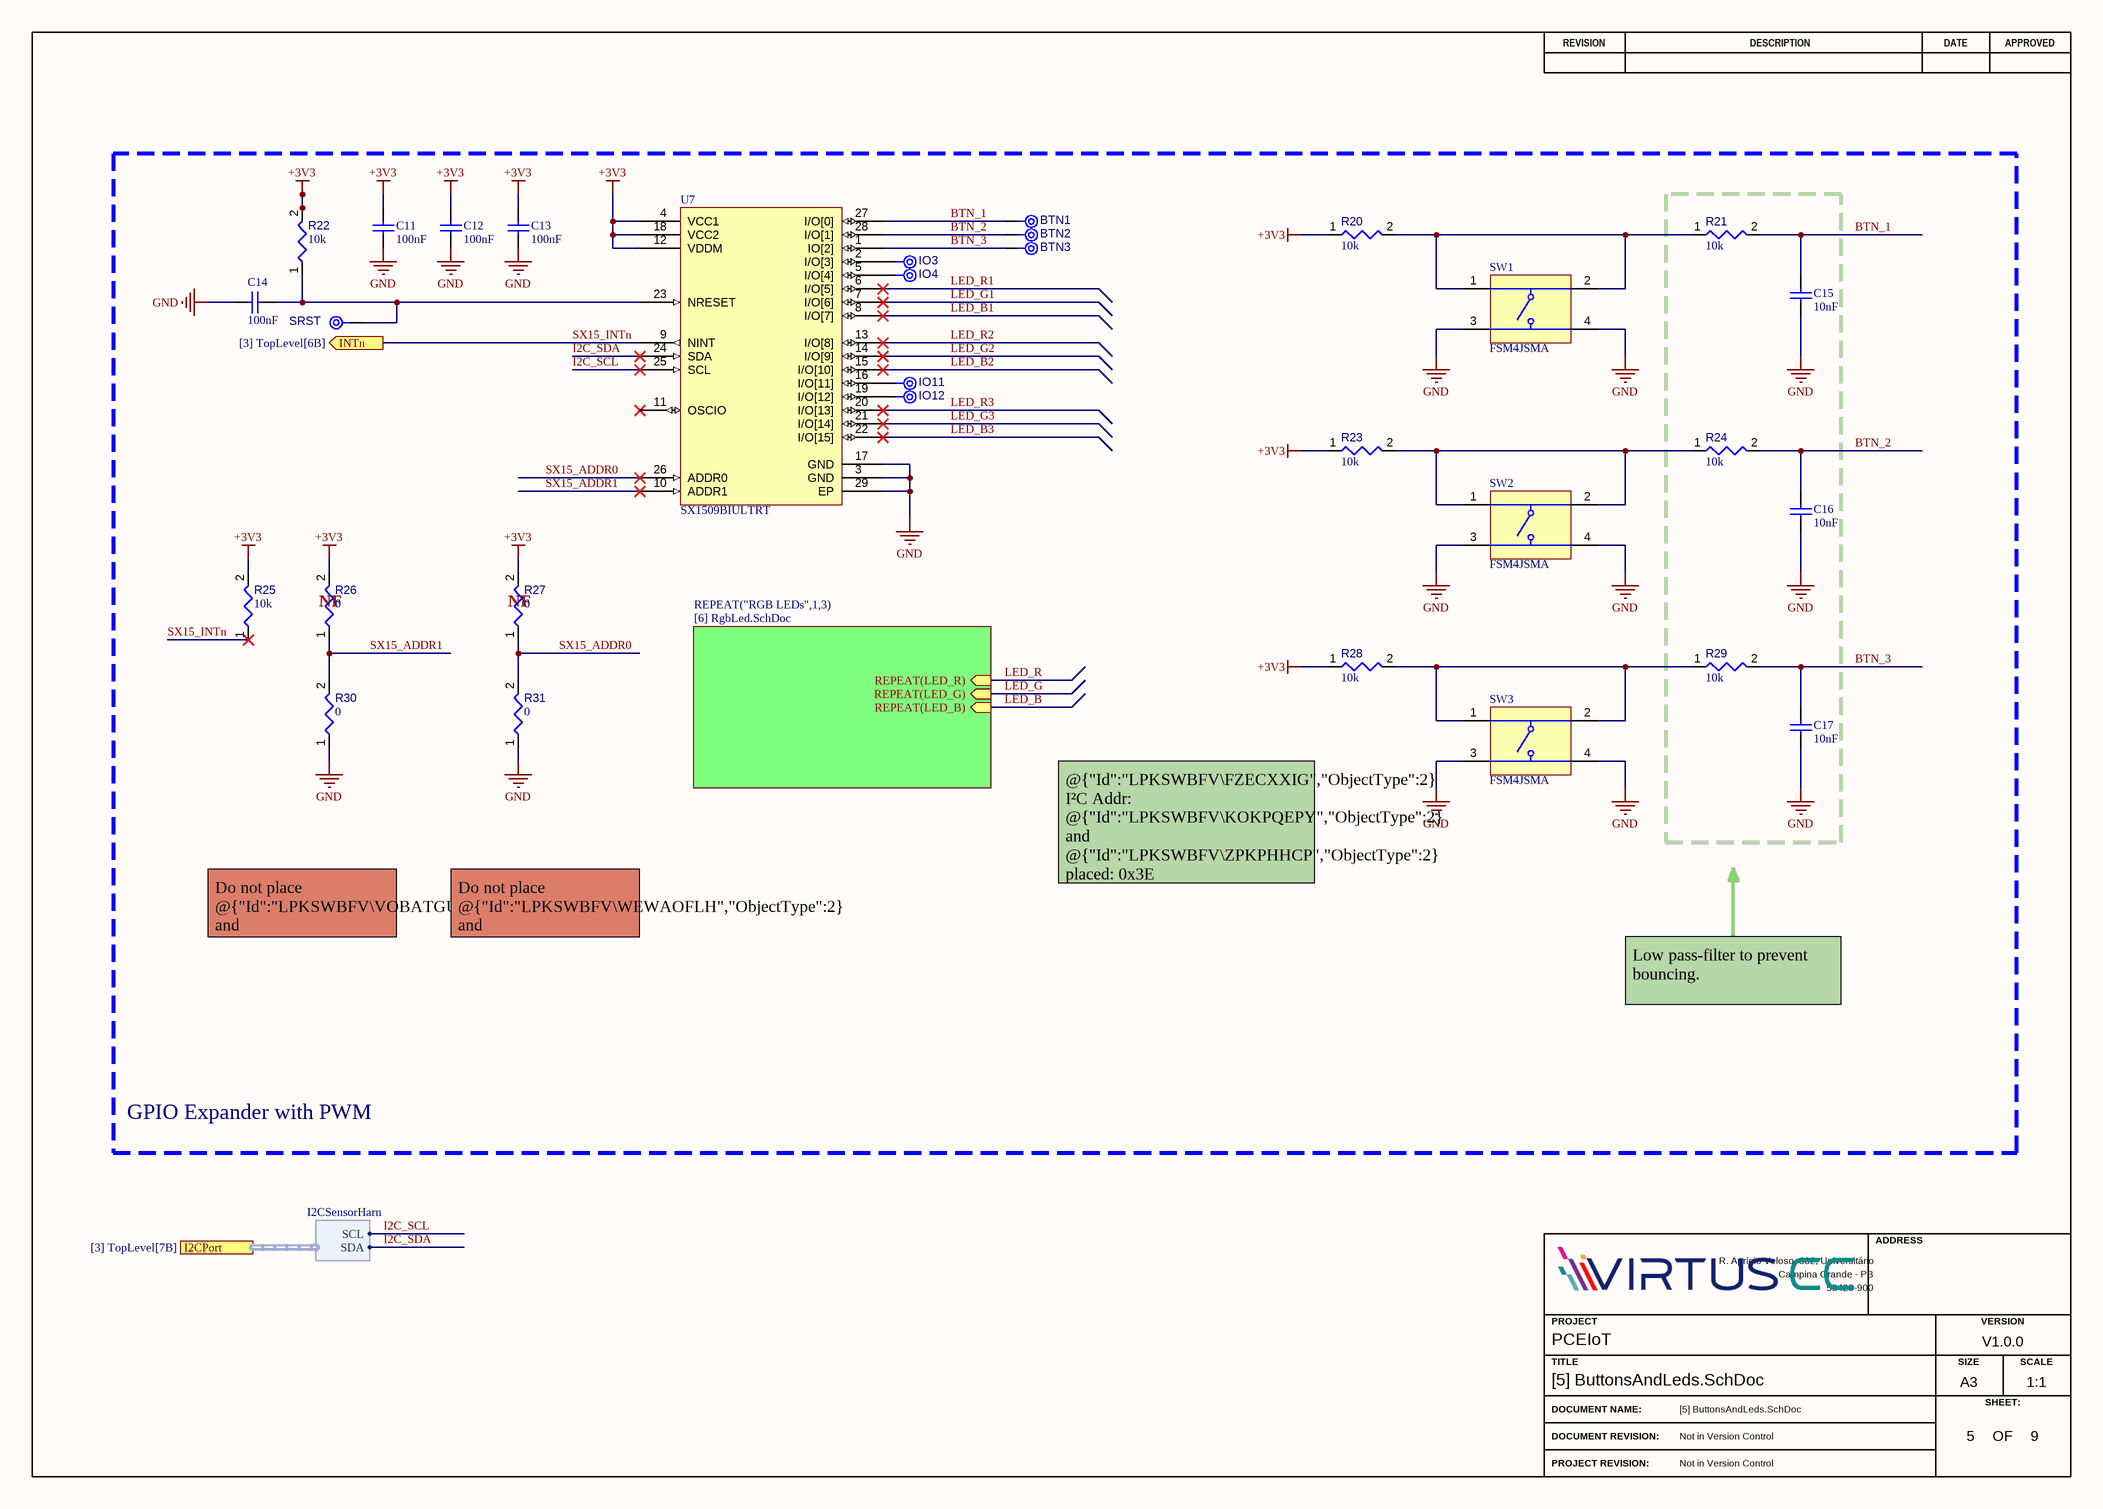
[diagram p6: [5] ButtonsAndLeds.SchDoc]

### Parts
BTN1  TPAD6R  [TP06R]  (value not drawn)  (no BOM)
BTN2  TPAD6R  [TP06R]  (value not drawn)  (no BOM)
BTN3  TPAD6R  [TP06R]  (value not drawn)  (no BOM)
C11  value 100nF  [CAPC0603(1608)100_L]  (hidden comment: VJ0603Y104MXJCW1BC)
C12  value 100nF  [CAPC0603(1608)100_L]  (hidden comment: VJ0603Y104MXJCW1BC)
C13  value 100nF  [CAPC0603(1608)100_L]  (hidden comment: VJ0603Y104MXJCW1BC)
C14  value 100nF  [CAPC0603(1608)100_L]  (hidden comment: VJ0603Y104MXJCW1BC)
C15  value 10nF  [CAPC0603(1608)100_L]  (hidden comment: VJ0603Y103KXAAC)
C16  value 10nF  [CAPC0603(1608)100_L]  (hidden comment: VJ0603Y103KXAAC)
C17  value 10nF  [CAPC0603(1608)100_L]  (hidden comment: VJ0603Y103KXAAC)
IO3  TPAD6R  [TP06R]  (value not drawn)  (no BOM)
IO4  TPAD6R  [TP06R]  (value not drawn)  (no BOM)
IO11  TPAD6R  [TP06R]  (value not drawn)  (no BOM)
IO12  TPAD6R  [TP06R]  (value not drawn)  (no BOM)
R20  value 10k  [RESC0603(1608)_L]  (hidden comment: Resistor 10k +/-1% 0603 100 mW)
R21  value 10k  [RESC0603(1608)_L]  (hidden comment: Resistor 10k +/-1% 0603 100 mW)
R22  value 10k  [RESC0603(1608)_L]  (hidden comment: Resistor 10k +/-1% 0603 100 mW)
R23  value 10k  [RESC0603(1608)_L]  (hidden comment: Resistor 10k +/-1% 0603 100 mW)
R24  value 10k  [RESC0603(1608)_L]  (hidden comment: Resistor 10k +/-1% 0603 100 mW)
R25  value 10k  [RESC0603(1608)_L]  (hidden comment: Resistor 10k +/-1% 0603 100 mW)
R26  value 0  [RESC0603(1608)_L]  (hidden comment: Resistor 0R +/- 5% 0603 100 mW)
R27  value 0  [RESC0603(1608)_L]  (hidden comment: Resistor 0R +/- 5% 0603 100 mW)
R28  value 10k  [RESC0603(1608)_L]  (hidden comment: Resistor 10k +/-1% 0603 100 mW)
R29  value 10k  [RESC0603(1608)_L]  (hidden comment: Resistor 10k +/-1% 0603 100 mW)
R30  value 0  [RESC0603(1608)_L]  (hidden comment: Resistor 0R +/- 5% 0603 100 mW)
R31  value 0  [RESC0603(1608)_L]  (hidden comment: Resistor 0R +/- 5% 0603 100 mW)
SRST  TPAD6R  [TP06R]  (value not drawn)  (no BOM)
SW1  FSM4JSMA  [TECO-FSM4JSMA_V]
SW2  FSM4JSMA  [TECO-FSM4JSMA_V]
SW3  FSM4JSMA  [TECO-FSM4JSMA_V]
U7  SX1509BIULTRT  [QFN40P410X410X60_HS-29N]

### Sub-sheets
REPEAT("RGB LEDs",1,3) = [6] RgbLed.SchDoc: REPEAT(LED_B) (in), REPEAT(LED_G) (in), REPEAT(LED_R) (in)

### Ports
I2CPort (harness I2CSensorHarn, see [3] TopLevel[7B]), INTn (out, see [3] TopLevel[6B])

### Harnesses
I2CSensorHarn: SCL, SDA

### Nets
+3V3: C11.2 C12.2 C13.2 R20.1 R22.2 R23.1 R25.2 R26.2 R27.2 R28.1 U7.4(VCC1) U7.12(VDDM) U7.18(VCC2)
GND: C11.1 C12.1 C13.1 C14.1 C15.1 C16.1 C17.1 R30.1 R31.1 SW1.3 SW1.4 SW2.3 SW2.4 SW3.3 SW3.4 U7.3(GND) U7.17(GND) U7.29(EP)
BTN_1: BTN1.1(TP) C15.2 R21.2 U7.27(I/O[0])
BTN_2: BTN2.1(TP) C16.2 R24.2 U7.28(I/O[1])
BTN_3: BTN3.1(TP) C17.2 R29.2 U7.1(IO[2])
I2C_SCL: U7.25(SCL) ; port I2CPort.SCL  [project net GP5/I2C0_SCL]
I2C_SDA: U7.24(SDA) ; port I2CPort.SDA  [project net GP4/I2C0_SDA]
LED_B: sheet REPEAT("RGB LEDs",1,3)/REPEAT(LED_B)
LED_B1: U7.8(I/O[7])  [project net LED_B]
LED_B2: U7.15(I/O[10])  [project net LED_B]
LED_B3: U7.22(I/O[15])  [project net LED_B]
LED_G: sheet REPEAT("RGB LEDs",1,3)/REPEAT(LED_G)
LED_G1: U7.7(I/O[6])  [project net LED_G]
LED_G2: U7.14(I/O[9])  [project net LED_G]
LED_G3: U7.21(I/O[14])  [project net LED_G]
LED_R: sheet REPEAT("RGB LEDs",1,3)/REPEAT(LED_R)
LED_R1: U7.6(I/O[5])  [project net LED_R]
LED_R2: U7.13(I/O[8])  [project net LED_R]
LED_R3: U7.20(I/O[13])  [project net LED_R]
SX15_ADDR0: R27.1 R31.2 U7.26(ADDR0)
SX15_ADDR1: R26.1 R30.2 U7.10(ADDR1)
SX15_INTn: R25.1 U7.9(NINT) ; port INTn  [project net GP11/SX_INTn]
NetC14_2: C14.2 R22.1 SRST.1(TP) U7.23(NRESET)
NetIO3_1: IO3.1(TP) U7.2(I/O[3])
NetIO4_1: IO4.1(TP) U7.5(I/O[4])
NetIO11_1: IO11.1(TP) U7.16(I/O[11])
NetIO12_1: IO12.1(TP) U7.19(I/O[12])
NetR20_2: R20.2 R21.1 SW1.1 SW1.2
NetR23_2: R23.2 R24.1 SW2.1 SW2.2
NetR28_2: R28.2 R29.1 SW3.1 SW3.2

Not connected (* = marked no-connect by the designer): U7 11(OSCIO)*

### Notes on the sheet
- (near R26) NF
- (near R27) NF
- @{"Id":"LPKSWBFV\FZECXXIG","ObjectType":2} I²C Addr:
  @{"Id":"LPKSWBFV\KOKPQEPY","ObjectType":2} and @{"Id":"LPKSWBFV\ZPKPHHCP","ObjectType":2} placed: 0x3E
  @{"Id":"LPKSWBFV\KOKPQEPY","ObjectType":2} and @{"Id":"LPKSWBFV\WEWAOFLH","ObjectType":2} placed: 0x3F
  @{"Id":"LPKSWBFV\VOBATGUE","ObjectType":2}  and @{"Id":"LPKSWBFV\ZPKPHHCP","ObjectType":2} placed: 0x70
  @{"Id":"LPKSWBFV\VOBATGUE","ObjectType":2} and @{"Id":"LPKSWBFV\WEWAOFLH","ObjectType":2} placed: 0x71
- Do not place @{"Id":"LPKSWBFV\VOBATGUE","ObjectType":2} and @{"Id":"LPKSWBFV\KOKPQEPY","ObjectType":2} simultaneously
- Do not place @{"Id":"LPKSWBFV\WEWAOFLH","ObjectType":2} and @{"Id":"LPKSWBFV\ZPKPHHCP","ObjectType":2} simultaneously
- Low pass-filter to prevent bouncing.
- GPIO Expander with PWM
- REVISION
- DESCRIPTION
- DATE
- APPROVED
- ADDRESS
- PROJECT
- VERSION
- TITLE
- A3
- SIZE
- SCALE
- DOCUMENT NAME:
- DOCUMENT REVISION:
- OF
- SHEET:
- PROJECT REVISION:

### Library data of the parts
BTN1-BTN3 IO3 IO4 IO11 IO12 SRST = CMP-00028-00002-2: 0.6mm round; Pins: 1; Component Type: Mechanical
C11-C14 = CMP-001-00085-1: as C18 on sheet [7] PowerManagement; Packaging: Tape and Reel; Min Operating Temperature: -55°C; Case/Package: 0603; Length: 1.6mm; Termination: SMD/SMT; Height: 0.95mm; Mounting Technology: Surface Mount; Width: 0.8mm; Case Code (Imperial): 0603; Construction: Flat; Lead Free: Lead Free; Package Quantity: 4000; Max Operating Temperature: 125°C; Dielectric: X7R; RoHS Compliant: Yes; Depth: 0.8mm; Tolerance: 20%; Series: VJ; Case Code (Metric): 1608; Voltage Rating (DC): 16V
C15-C17 = CMP-001-00084-1: Multilayer Ceramic Capacitor, 0.01 uF, 50 V, ± 10%, X7R, 0603 [1608 Metric]; Voltage Rating: 50V; Height: 0.92mm; Voltage Rating (DC): 50V; Depth: 0.8mm; Case Code (Imperial): 0603; Packaging: Tape and Reel; Length: 1.6mm; Max Operating Temperature: 125°C; Min Operating Temperature: -55°C; Case/Package: 0603; Pins: 2; Series: VJ; Thickness: 0.036inch; Weight: 7.1E-05oz; Reach SVHC Compliant: Unknown; Termination: SMD/SMT; Package Quantity: 1; RoHS Compliant: Yes; Mounting Technology: Surface Mount; Construction: Flat; Voltage: 50V; Lead Free: Lead Free; Width: 0.031inch; Case Code (Metric): 1608; Tolerance: 10%; Dielectric: X7R
R20-R25 R28 R29 = CMP-009-00017-7: as R1 on sheet [3] TopLevel; Mounting Technology: SM; Max Operating Temperature: 155°C; Case/Package: 0603; Tolerance: 1%; RoHS Compliant: True; Pins: 2; Min Operating Temperature: -55°C
R26 R27 R30 R31 = CMP-009-00006-6: as R4 on sheet [3] TopLevel; Tolerance: 5%; Mounting Technology: SM; RoHS Compliant: True; Max Operating Temperature: 155°C; Min Operating Temperature: -55°C; Case/Package: 0603; Pins: 2
SW1-SW3 = CMP-011-00013-1: Switch Tactile OFF (ON) SPST Round Button Gull Wing 0.05A 12VDC 1.57N SMD Loose Piece; Max Current Rating: 50mA; Actuator Type: Standard; Switch Function: Off-Mom; Switch Travel: 0.25mm; Mechanical Life: 100000Cycles; Insulation Resistance: 100MR; Actuator Length: 1.4mm; Voltage Rating: 24V; Actuator Material: Polyphenylene; Illumination Type: Non-Illuminated,Illuminated; Contact Material: Copper Alloy,Silver; Throw Configuration: SPST; Termination: Gull Wing; Depth: 10mm; Series: FSMJSMA; Contact Current Rating: 50mA; ELV: Compliant; Min Operating Temperature: -35°C; Case/Package: SMD/SMT; Length: 6mm; Width: 6mm; Package Quantity: 750; Color: Black; Reach SVHC Compliant: Unknown; Contact Plating: Silver; Operating Force: 1.57N; Current Rating: 50mA; RoHS Compliant: Yes; Max Operating Temperature: 85°C; Lead Free: Lead Free; Voltage Rating (DC): 24V; Packaging: Bulk; Orientation: Straight; Mounting Technology: Surface Mount
U7 = CMP-016-00011-5: IC Gpio Expander I2C 16CH 28QFN / I2C Interface 5.5V 28-PIN Qfn-ut Ep T/r; Number of I/Os: 16; Frequency: 400kHz; Interface: I2C; Series: -; Min Operating Temperature: -40°C; RoHS Compliant: Yes; Pins: 28; Packaging: Cut Tape; Max Operating Temperature: 85°C; Mounting Technology: Surface Mount; Case/Package: QFN; Lead Free: Lead Free